# EAGLE design i2cRelay12 (EAGLE 9.2.2)
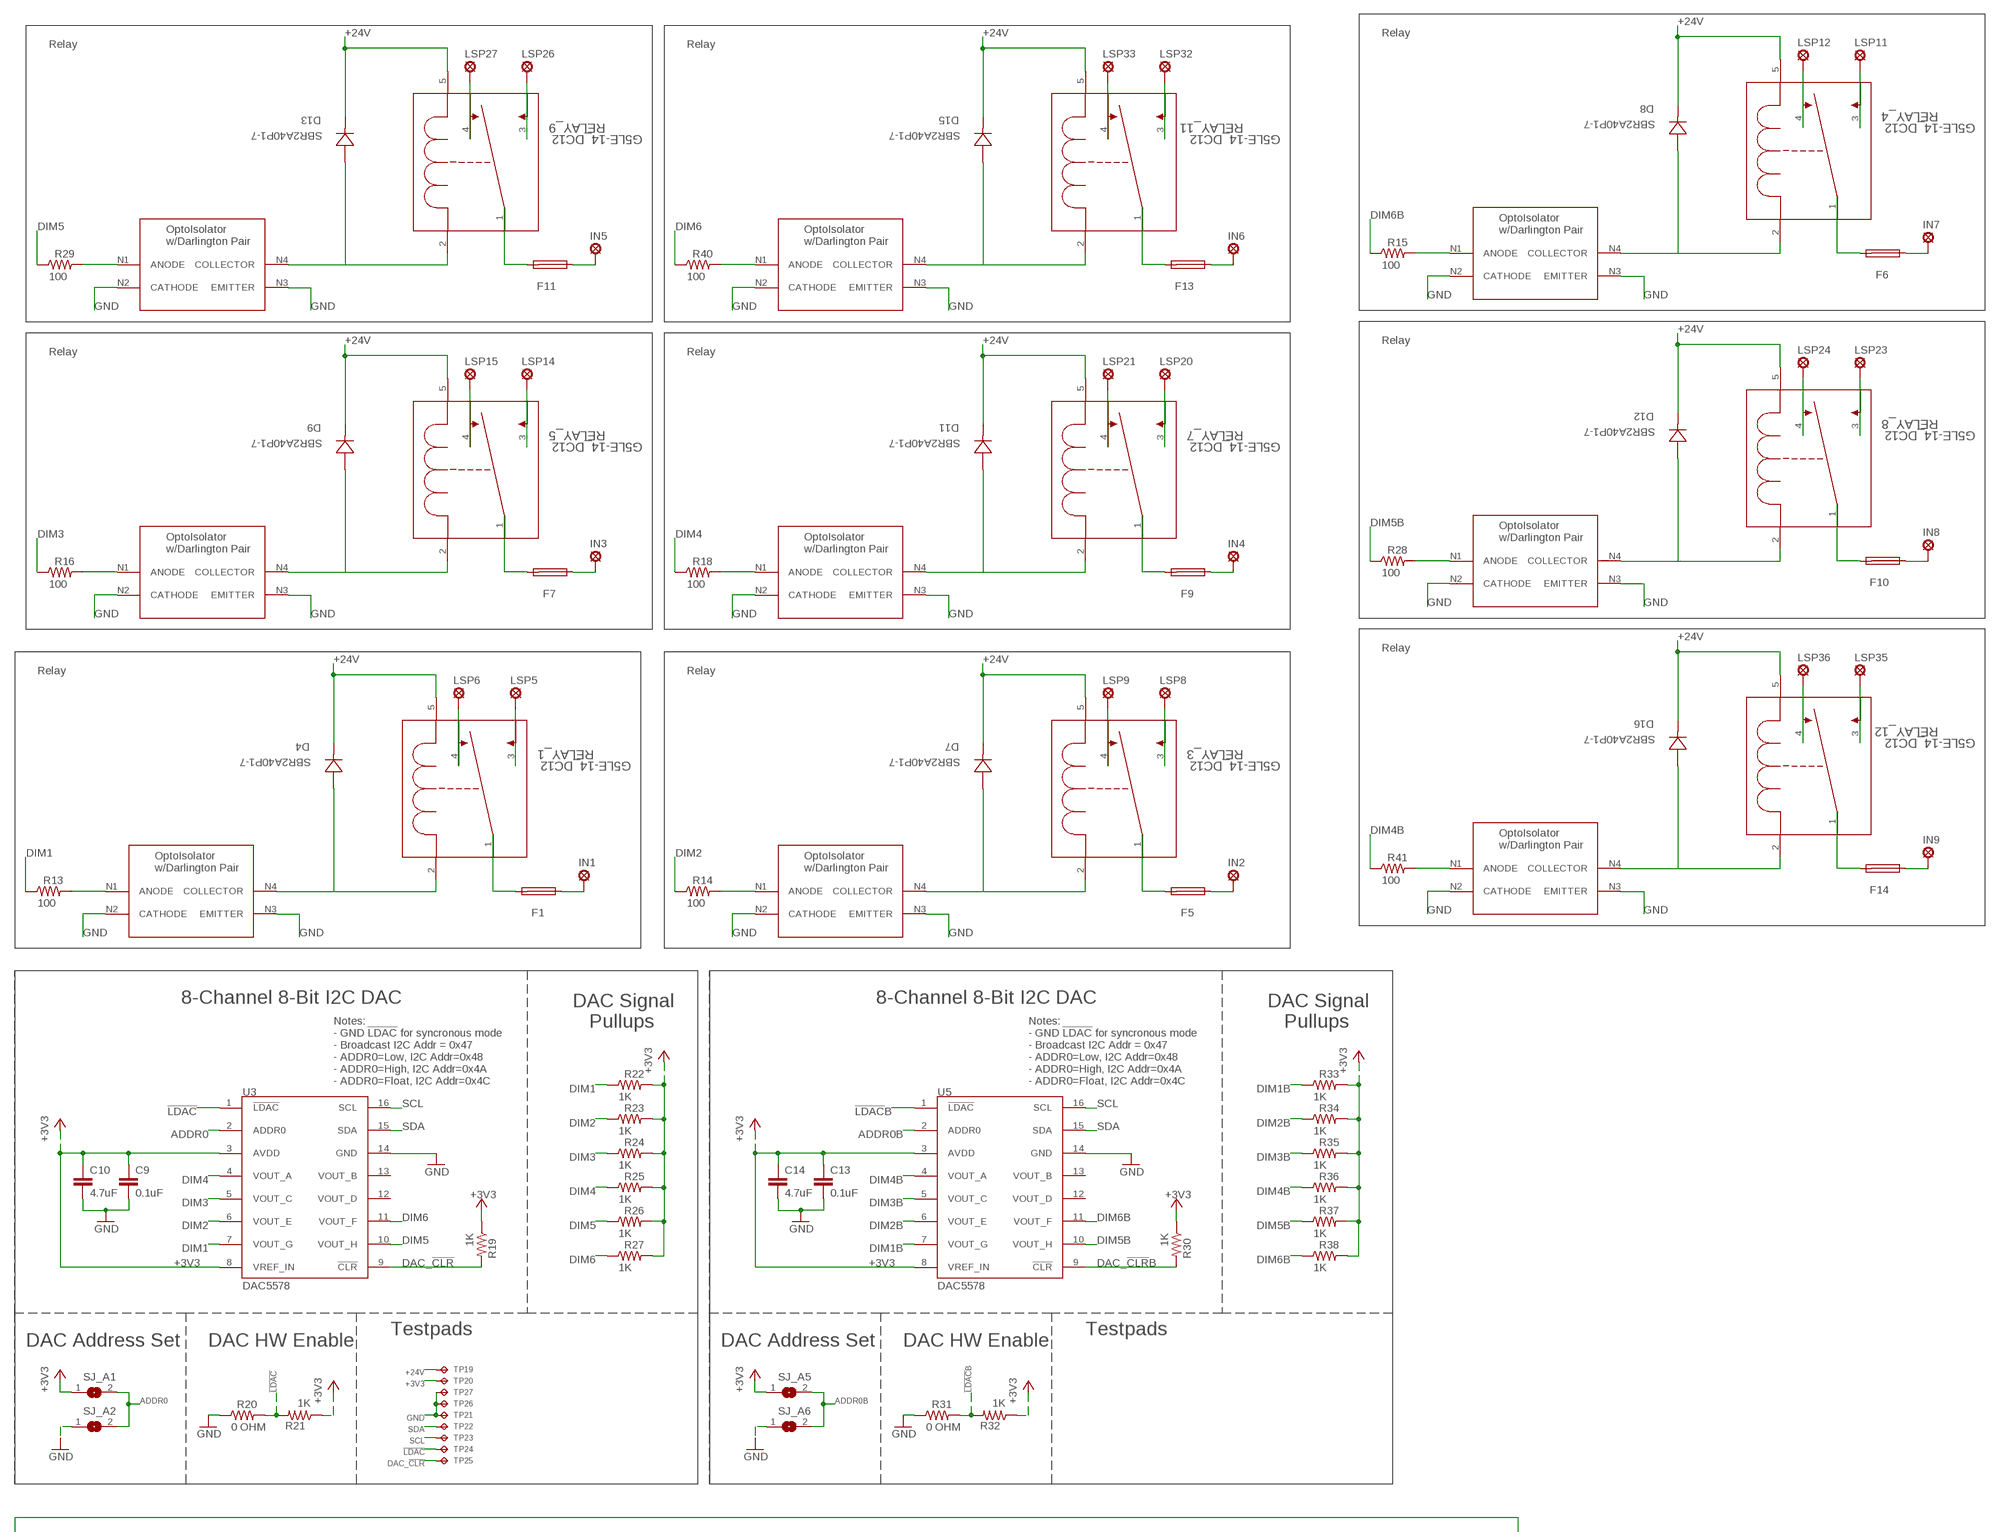
[diagram p0: schematic, sheet 1, part 1 of 3]
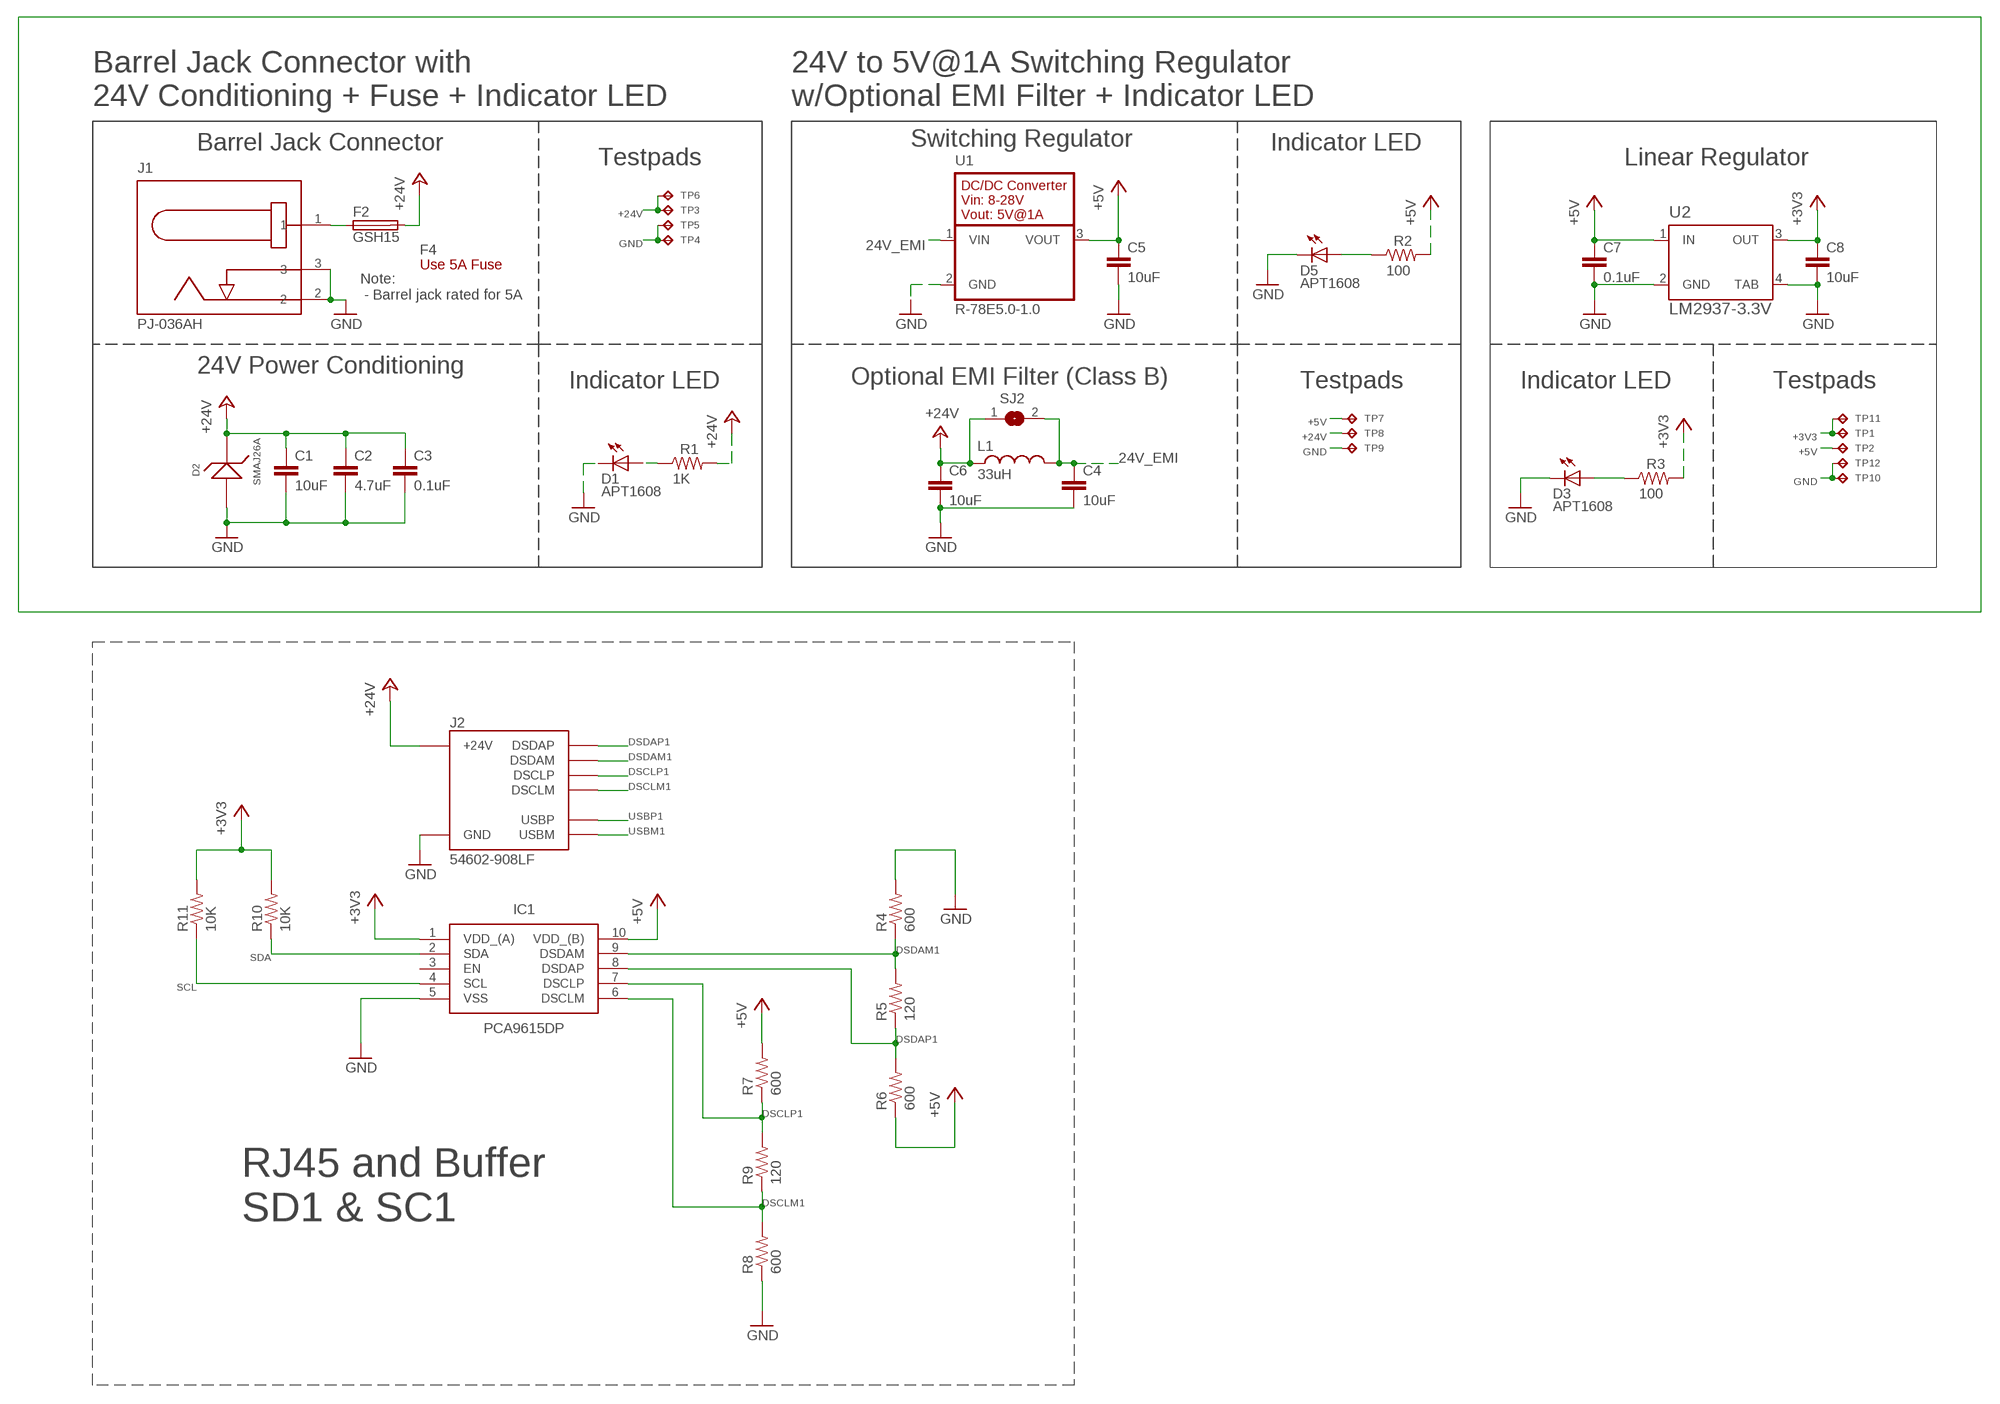
[diagram p1: schematic, sheet 1, part 2 of 3]
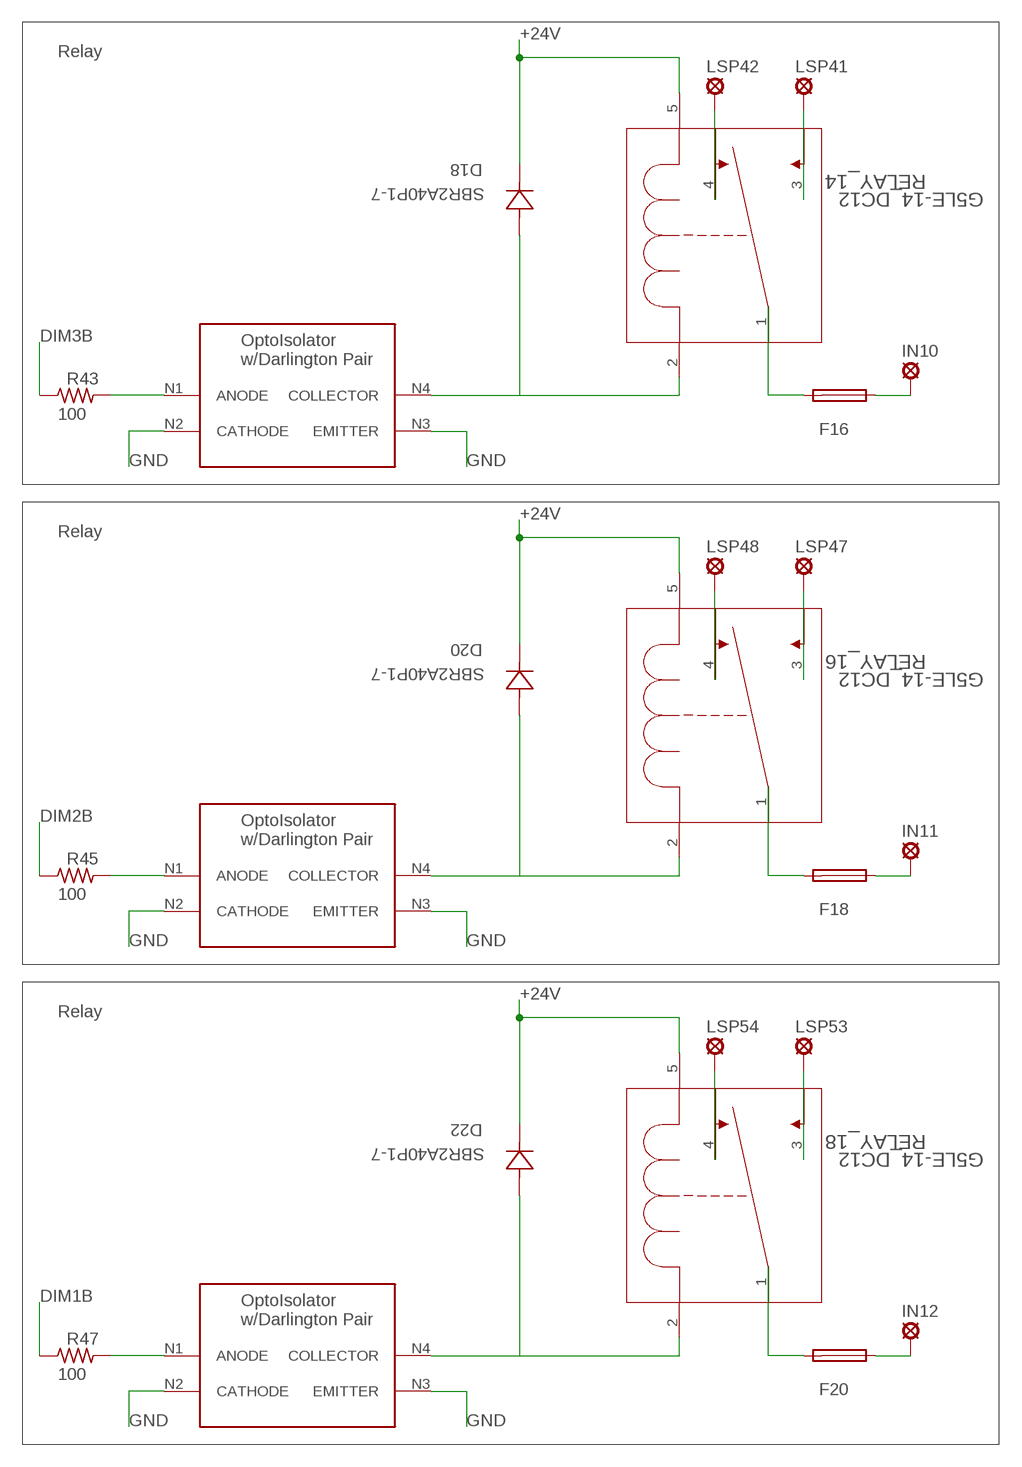
[diagram p2: schematic, sheet 1, part 3 of 3]

## Parts
C1  10uF  10UF-GMK212BBJ106KG-T  [C0805]
C2  4.7uF  4.7UF-CL21A475KBQNNNE  [C0805]
C3  0.1uF  0.1UF-C0603C104K5RACTU  [C0603]
C4  10uF  10UF-GMK212BBJ106KG-T  [C0805]
C5  10uF  10UF-GMK212BBJ106KG-T  [C0805]
C6  10uF  10UF-GMK212BBJ106KG-T  [C0805]
C7  0.1uF  0.1UF-C0603C104K5RACTU  [C0603]
C8  10uF  10UF-GMK212BBJ106KG-T  [C0805]
C9  0.1uF  0.1UF-C0603C104K5RACTU  [C0603]
C10  4.7uF  4.7UF-CL21A475KBQNNNE  [C0805]
C13  0.1uF  0.1UF-C0603C104K5RACTU  [C0603]
C14  4.7uF  4.7UF-CL21A475KBQNNNE  [C0805]
D1  APT1608  APT1608CGCK  [CHIPLED_0603]
D2  SMAJ26A  SMAJ26A-13-F  [SMA]
D3  APT1608  APT1608CGCK  [CHIPLED_0603]
D4  SBR2A40P1-7  [POWERDI123]
D5  APT1608  APT1608CGCK  [CHIPLED_0603]
D7  SBR2A40P1-7  [POWERDI123]
D8  SBR2A40P1-7  [POWERDI123]
D9  SBR2A40P1-7  [POWERDI123]
D11  SBR2A40P1-7  [POWERDI123]
D12  SBR2A40P1-7  [POWERDI123]
D13  SBR2A40P1-7  [POWERDI123]
D15  SBR2A40P1-7  [POWERDI123]
D16  SBR2A40P1-7  [POWERDI123]
D18  SBR2A40P1-7  [POWERDI123]
D20  SBR2A40P1-7  [POWERDI123]
D22  SBR2A40P1-7  [POWERDI123]
F1  GSH15  [GSH15]
F2  GSH15  [GSH15]
F4  Use 5A Fuse  0217005.MXP  [FUSE-CARTRIDGE]
F5  GSH15  [GSH15]
F6  GSH15  [GSH15]
F7  GSH15  [GSH15]
F9  GSH15  [GSH15]
F10  GSH15  [GSH15]
F11  GSH15  [GSH15]
F13  GSH15  [GSH15]
F14  GSH15  [GSH15]
F16  GSH15  [GSH15]
F18  GSH15  [GSH15]
F20  GSH15  [GSH15]
IC1  PCA9615DP  [SOP50P490X110-10N]
IN1  SE14  [SE14]
IN2  SE14  [SE14]
IN3  SE14  [SE14]
IN4  SE14  [SE14]
IN5  SE14  [SE14]
IN6  SE14  [SE14]
IN7  SE14  [SE14]
IN8  SE14  [SE14]
IN9  SE14  [SE14]
IN10  SE14  [SE14]
IN11  SE14  [SE14]
IN12  SE14  [SE14]
J1  PJ-036AH  BARREL-JACK-PJ-036AH-SMT-TR  [BARREL-JACK-PJ-036AH]
J2  54602-908LF  OPENAG-V1-RJ45PTH  [OPENAG-V1-RJ45]
L1  33uH  33UH-29333C  [29333C]
LSP5  SE14  [SE14]
LSP6  SE14  [SE14]
LSP8  SE14  [SE14]
LSP9  SE14  [SE14]
LSP11  SE14  [SE14]
LSP12  SE14  [SE14]
LSP14  SE14  [SE14]
LSP15  SE14  [SE14]
LSP20  SE14  [SE14]
LSP21  SE14  [SE14]
LSP23  SE14  [SE14]
LSP24  SE14  [SE14]
LSP26  SE14  [SE14]
LSP27  SE14  [SE14]
LSP32  SE14  [SE14]
LSP33  SE14  [SE14]
LSP35  SE14  [SE14]
LSP36  SE14  [SE14]
LSP41  SE14  [SE14]
LSP42  SE14  [SE14]
LSP47  SE14  [SE14]
LSP48  SE14  [SE14]
LSP53  SE14  [SE14]
LSP54  SE14  [SE14]
R1  1K  1K-ERJ-PB3D1001V  [RC0603N]
R2  100  100OHM-RC0603JR-07100RL  [RC0603N]
R3  100  100OHM-RC0603JR-07100RL  [RC0603N]
R4  600  R-US_R0603  [R0603]
R5  120  R-US_R0603  [R0603]
R6  600  R-US_R0603  [R0603]
R7  600  R-US_R0603  [R0603]
R8  600  R-US_R0603  [R0603]
R9  120  R-US_R0603  [R0603]
R10  10K  R-US_R0603  [R0603]
R11  10K  R-US_R0603  [R0603]
R13  100  100OHM-RC0603JR-07100RL  [RC0603N]
R14  100  100OHM-RC0603JR-07100RL  [RC0603N]
R15  100  100OHM-RC0603JR-07100RL  [RC0603N]
R16  100  100OHM-RC0603JR-07100RL  [RC0603N]
R18  100  100OHM-RC0603JR-07100RL  [RC0603N]
R19  1K  1K-ERJ-PB3D1001V  [RC0603N]
R20  0 OHM  0OHM-RC0603JR-070RL  [RC0603N]
R21  1K  1K-ERJ-PB3D1001V  [RC0603N]
R22  1K  1K-ERJ-PB3D1001V  [RC0603N]
R23  1K  1K-ERJ-PB3D1001V  [RC0603N]
R24  1K  1K-ERJ-PB3D1001V  [RC0603N]
R25  1K  1K-ERJ-PB3D1001V  [RC0603N]
R26  1K  1K-ERJ-PB3D1001V  [RC0603N]
R27  1K  1K-ERJ-PB3D1001V  [RC0603N]
R28  100  100OHM-RC0603JR-07100RL  [RC0603N]
R29  100  100OHM-RC0603JR-07100RL  [RC0603N]
R30  1K  1K-ERJ-PB3D1001V  [RC0603N]
R31  0 OHM  0OHM-RC0603JR-070RL  [RC0603N]
R32  1K  1K-ERJ-PB3D1001V  [RC0603N]
R33  1K  1K-ERJ-PB3D1001V  [RC0603N]
R34  1K  1K-ERJ-PB3D1001V  [RC0603N]
R35  1K  1K-ERJ-PB3D1001V  [RC0603N]
R36  1K  1K-ERJ-PB3D1001V  [RC0603N]
R37  1K  1K-ERJ-PB3D1001V  [RC0603N]
R38  1K  1K-ERJ-PB3D1001V  [RC0603N]
R40  100  100OHM-RC0603JR-07100RL  [RC0603N]
R41  100  100OHM-RC0603JR-07100RL  [RC0603N]
R43  100  100OHM-RC0603JR-07100RL  [RC0603N]
R45  100  100OHM-RC0603JR-07100RL  [RC0603N]
R47  100  100OHM-RC0603JR-07100RL  [RC0603N]
RELAY_1  G5LE-14_DC12  [RELAY_G5LE-1]
RELAY_3  G5LE-14_DC12  [RELAY_G5LE-1]
RELAY_4  G5LE-14_DC12  [RELAY_G5LE-1]
RELAY_5  G5LE-14_DC12  [RELAY_G5LE-1]
RELAY_7  G5LE-14_DC12  [RELAY_G5LE-1]
RELAY_8  G5LE-14_DC12  [RELAY_G5LE-1]
RELAY_9  G5LE-14_DC12  [RELAY_G5LE-1]
RELAY_11  G5LE-14_DC12  [RELAY_G5LE-1]
RELAY_12  G5LE-14_DC12  [RELAY_G5LE-1]
RELAY_14  G5LE-14_DC12  [RELAY_G5LE-1]
RELAY_16  G5LE-14_DC12  [RELAY_G5LE-1]
RELAY_18  G5LE-14_DC12  [RELAY_G5LE-1]
SJ2  EMI-BYPASS  [EMI-BYPASS]
SJ_A1  SOLDERJUMPERREFLOW_NOPASTE  [SJ1]
SJ_A2  SOLDERJUMPERREFLOW_NOPASTE  [SJ1]
SJ_A5  SOLDERJUMPERREFLOW_NOPASTE  [SJ1]
SJ_A6  SOLDERJUMPERREFLOW_NOPASTE  [SJ1]
TP1  TPTP04R  [TP04R]
TP2  TPTP04R  [TP04R]
TP3  TPTP04R  [TP04R]
TP4  TPTP04R  [TP04R]
TP5  TPTP04R  [TP04R]
TP6  TPTP04R  [TP04R]
TP7  TPTP06R  [TP06R]
TP8  TPTP06R  [TP06R]
TP9  TPTP06R  [TP06R]
TP10  TPTP04R  [TP04R]
TP11  TPTP04R  [TP04R]
TP12  TPTP04R  [TP04R]
TP19  TPTP04R  [TP04R]
TP20  TPTP04R  [TP04R]
TP21  TPTP04R  [TP04R]
TP22  TPTP04R  [TP04R]
TP23  TPTP04R  [TP04R]
TP24  TPTP04R  [TP04R]
TP25  TPTP04R  [TP04R]
TP26  TPTP04R  [TP04R]
TP27  TPTP04R  [TP04R]
U1  R-78E5.0-1.0  [R-78E5.0-1.0]
U2  LM2937-3.3V  LM2937IMP-3.3/NOPB  [MP04A]
U3  DAC5578  DAC5578SPW  [TSSOP16]
U5  DAC5578  DAC5578SPW  [TSSOP16]
U$3  LTV-355T  [LTV-355T]
U$4  LTV-355T  [LTV-355T]
U$5  LTV-355T  [LTV-355T]
U$6  LTV-355T  [LTV-355T]
U$8  LTV-355T  [LTV-355T]
U$9  LTV-355T  [LTV-355T]
U$10  LTV-355T  [LTV-355T]
U$12  LTV-355T  [LTV-355T]
U$13  LTV-355T  [LTV-355T]
U$15  LTV-355T  [LTV-355T]
U$17  LTV-355T  [LTV-355T]
U$19  LTV-355T  [LTV-355T]

## Nets
24V_EMI: C4.1 L1.2 SJ2.2 U1.1(VIN)
24V_IN1: F2.1 J1.1
!LDAC!: R20.2 R21.2 TP24.1(TP) U3.1(!LDAC!)
!LDAC!B: R31.2 R32.2 U5.1(!LDAC!)
+3V3: C8.1 C9.1 C10.1 C13.1 C14.1 IC1.1(VDD_(A)) R3.2 R10.2 R11.2 R19.1 R21.1 R22.2 R23.2 R24.2 R25.2 R26.2 R27.2 R30.1 R32.1 R33.2 R34.2 R35.2 R36.2 R37.2 R38.2 SJ_A1.1 SJ_A5.1 TP1.1(TP) TP11.1(TP) TP20.1(TP) U2.3(OUT) U3.3(AVDD) U3.8(VREF_IN) U5.3(AVDD) U5.8(VREF_IN)
+5V: C5.1 C7.1 IC1.10(VDD_(B)) R2.2 R6.1 R7.2 TP2.1(TP) TP7.TP U1.3(VOUT) U2.1(IN)
+24V: C1.1 C2.1 C3.1 C6.1 D2.1 D4.- D7.- D8.- D9.- D11.- D12.- D13.- D15.- D16.- D18.- D20.- D22.- F2.2 J2.24V(6)(+24V) L1.1 R1.2 RELAY_1.5 RELAY_3.5 RELAY_4.5 RELAY_5.5 RELAY_7.5 RELAY_8.5 RELAY_9.5 RELAY_11.5 RELAY_12.5 RELAY_14.5 RELAY_16.5 RELAY_18.5 SJ2.1 TP3.1(TP) TP6.1(TP) TP8.TP TP19.1(TP)
ADDR0: SJ_A1.2 SJ_A2.2 U3.2(ADDR0)
ADDR0B: SJ_A5.2 SJ_A6.2 U5.2(ADDR0)
DAC_!CLR!: R19.2 TP25.1(TP) U3.9(!CLR!)
DAC_!CLR!B: R30.2 U5.9(!CLR!)
DIM1: R13.1 R22.1 U3.7(VOUT_G)
DIM1B: R33.1 R47.1 U5.7(VOUT_G)
DIM2: R14.1 R23.1 U3.6(VOUT_E)
DIM2B: R34.1 R45.1 U5.6(VOUT_E)
DIM3: R16.1 R24.1 U3.5(VOUT_C)
DIM3B: R35.1 R43.1 U5.5(VOUT_C)
DIM4: R18.1 R25.1 U3.4(VOUT_A)
DIM4B: R36.1 R41.1 U5.4(VOUT_A)
DIM5: R26.1 R29.1 U3.10(VOUT_H)
DIM5B: R28.1 R37.1 U5.10(VOUT_H)
DIM6: R27.1 R40.1 U3.11(VOUT_F)
DIM6B: R15.1 R38.1 U5.11(VOUT_F)
DSCLM1: IC1.6(DSCLM) J2.DSCLM(5)(DSCLM) R8.2 R9.1
DSCLP1: IC1.7(DSCLP) J2.DSCLP(4)(DSCLP) R7.1 R9.2
DSDAM1: IC1.9(DSDAM) J2.DSDAM(2)(DSDAM) R4.1 R5.2
DSDAP1: IC1.8(DSDAP) J2.DSDAP(1)(DSDAP) R5.1 R6.2
GND: C1.2 C2.2 C3.2 C4.2 C5.2 C6.2 C7.2 C8.2 C9.2 C10.2 C13.2 C14.2 D1.C D2.2 D3.C D5.C IC1.5(VSS) J1.2 J1.3 J2.GND(3)(GND) R4.2 R8.1 R20.1 R31.1 SJ_A2.1 SJ_A6.1 TP4.1(TP) TP5.1(TP) TP9.TP TP10.1(TP) TP12.1(TP) TP21.1(TP) TP26.1(TP) TP27.1(TP) U1.2(GND) U2.2(GND) U2.4(TAB) U3.14(GND) U5.14(GND) U$3.N2(CATHODE) U$3.N3(EMITTER) U$4.N2(CATHODE) U$4.N3(EMITTER) U$5.N2(CATHODE) U$5.N3(EMITTER) U$6.N2(CATHODE) U$6.N3(EMITTER) U$8.N2(CATHODE) U$8.N3(EMITTER) U$9.N2(CATHODE) U$9.N3(EMITTER) U$10.N2(CATHODE) U$10.N3(EMITTER) U$12.N2(CATHODE) U$12.N3(EMITTER) U$13.N2(CATHODE) U$13.N3(EMITTER) U$15.N2(CATHODE) U$15.N3(EMITTER) U$17.N2(CATHODE) U$17.N3(EMITTER) U$19.N2(CATHODE) U$19.N3(EMITTER)
N$1: D1.A R1.1
N$3: D5.A R2.1
N$4: D3.A R3.1
N$7: D4.+ RELAY_1.2 U$3.N4(COLLECTOR)
N$11: F1.2 RELAY_1.1
N$13: LSP5.MP RELAY_1.3
N$14: R13.2 U$3.N1(ANODE)
N$15: LSP6.MP RELAY_1.4
N$16: F1.1 IN1.MP
N$17: D7.+ RELAY_3.2 U$4.N4(COLLECTOR)
N$18: F5.2 RELAY_3.1
N$19: LSP8.MP RELAY_3.3
N$20: R14.2 U$4.N1(ANODE)
N$21: LSP9.MP RELAY_3.4
N$22: F5.1 IN2.MP
N$23: D8.+ RELAY_4.2 U$5.N4(COLLECTOR)
N$24: F6.2 RELAY_4.1
N$25: LSP11.MP RELAY_4.3
N$26: R15.2 U$5.N1(ANODE)
N$27: LSP12.MP RELAY_4.4
N$28: F6.1 IN7.MP
N$29: D9.+ RELAY_5.2 U$6.N4(COLLECTOR)
N$30: F7.2 RELAY_5.1
N$31: LSP14.MP RELAY_5.3
N$32: R16.2 U$6.N1(ANODE)
N$33: LSP15.MP RELAY_5.4
N$34: F7.1 IN3.MP
N$41: D11.+ RELAY_7.2 U$8.N4(COLLECTOR)
N$42: F9.2 RELAY_7.1
N$43: LSP20.MP RELAY_7.3
N$44: R18.2 U$8.N1(ANODE)
N$45: LSP21.MP RELAY_7.4
N$46: F9.1 IN4.MP
N$47: D12.+ RELAY_8.2 U$9.N4(COLLECTOR)
N$48: F10.2 RELAY_8.1
N$49: LSP23.MP RELAY_8.3
N$50: R28.2 U$9.N1(ANODE)
N$51: LSP24.MP RELAY_8.4
N$52: F10.1 IN8.MP
N$53: D13.+ RELAY_9.2 U$10.N4(COLLECTOR)
N$54: F11.2 RELAY_9.1
N$55: LSP26.MP RELAY_9.3
N$56: R29.2 U$10.N1(ANODE)
N$57: LSP27.MP RELAY_9.4
N$58: F11.1 IN5.MP
N$65: D15.+ RELAY_11.2 U$12.N4(COLLECTOR)
N$66: F13.2 RELAY_11.1
N$67: LSP32.MP RELAY_11.3
N$68: R40.2 U$12.N1(ANODE)
N$69: LSP33.MP RELAY_11.4
N$70: F13.1 IN6.MP
N$71: D16.+ RELAY_12.2 U$13.N4(COLLECTOR)
N$72: F14.2 RELAY_12.1
N$73: LSP35.MP RELAY_12.3
N$74: R41.2 U$13.N1(ANODE)
N$75: LSP36.MP RELAY_12.4
N$76: F14.1 IN9.MP
N$83: D18.+ RELAY_14.2 U$15.N4(COLLECTOR)
N$84: F16.2 RELAY_14.1
N$85: LSP41.MP RELAY_14.3
N$86: R43.2 U$15.N1(ANODE)
N$87: LSP42.MP RELAY_14.4
N$88: F16.1 IN10.MP
N$95: D20.+ RELAY_16.2 U$17.N4(COLLECTOR)
N$96: F18.2 RELAY_16.1
N$97: LSP47.MP RELAY_16.3
N$98: R45.2 U$17.N1(ANODE)
N$99: LSP48.MP RELAY_16.4
N$100: F18.1 IN11.MP
N$107: D22.+ RELAY_18.2 U$19.N4(COLLECTOR)
N$108: F20.2 RELAY_18.1
N$109: LSP53.MP RELAY_18.3
N$110: R47.2 U$19.N1(ANODE)
N$111: LSP54.MP RELAY_18.4
N$112: F20.1 IN12.MP
SCL: IC1.4(SCL) R11.1 TP23.1(TP) U3.16(SCL) U5.16(SCL)
SDA: IC1.2(SDA) R10.1 TP22.1(TP) U3.15(SDA) U5.15(SDA)
USBM1: J2.USBM(8)(USBM)
USBP1: J2.USBP(7)(USBP)
Unconnected: IC1.3(EN) U3.12(VOUT_D) U3.13(VOUT_B) U5.12(VOUT_D) U5.13(VOUT_B)

## Notes on the sheet
- Relay | Relay
- Relay | Relay
- Relay | Relay
- Relay | Relay
- Relay | Relay
- Relay | Relay
- 8-Channel 8-Bit I2C DAC | 8-Channel 8-Bit I2C DAC
- DAC Signal 
     Pullups
- DAC Signal 
     Pullups
- Notes:
  - GND !LDAC! for syncronous mode
  - Broadcast I2C Addr = 0x47
  - ADDR0=Low, I2C Addr=0x48
  - ADDR0=High, I2C Addr=0x4A
  - ADDR0=Float, I2C Addr=0x4C
- Notes:
  - GND !LDAC! for syncronous mode
  - Broadcast I2C Addr = 0x47
  - ADDR0=Low, I2C Addr=0x48
  - ADDR0=High, I2C Addr=0x4A
  - ADDR0=Float, I2C Addr=0x4C
- Testpads | Testpads
- DAC Address Set | DAC HW Enable | DAC Address Set | DAC HW Enable
- Barrel Jack Connector with
  24V Conditioning + Fuse + Indicator LED
- 24V to 5V@1A Switching Regulator
  w/Optional EMI Filter + Indicator LED
- Barrel Jack Connector | Switching Regulator | Indicator LED
- Testpads | Linear Regulator
- Note:
   - Barrel jack rated for 5A
- 24V Power Conditioning
- Indicator LED | Optional EMI Filter (Class B) | Testpads | Indicator LED | Testpads
- RJ45 and Buffer
  SD1 & SC1

## Library data of the parts
C1 C4-C6 C8 = openag-capacitors:10UF-GMK212BBJ106KG-T: CAP CER 10UF 35V X5R 0805 Description: 10µF ±10% 35V Ceramic Capacitor X5R 0805 (2012 Metric) Technical Specifications: Capacitance: 10µF Tolerance: ±10% Rated Voltage: 35V Temperature Coefficient: X5R Operating Temperature: -55°C ~ 85°C Package / Case: 0805 (2012 Metric) Datasheet(s): GMK212BBJ106KG-T Spec <http://ds.yuden.co.jp/TYCOMPAS/ut/detail.do?productNo=GMK212BBJ106KG-T&fileName=GMK212BBJ106KG-T_SS&mode=specSheetDownload> Vendor(s): Digikey: 587-4893-1-ND <https://www.digikey.com/product-detail/en/taiyo-yuden/GMK212BBJ106KG-T/587-4893-1-ND/6563736>; MANUFACTURER: Taiyo Yuden; MPN: GMK212BBJ106KG-T; VENDOR: Digikey; VLINK: https://www.digikey.com/product-detail/en/taiyo-yuden/GMK212BBJ106KG-T/587-4893-1-ND/6563736; VPN: 587-4893-1-ND
C2 C10 C14 = openag-capacitors:4.7UF-CL21A475KBQNNNE: CAP CER 4.7UF 50V X5R 0805 Description: 4.7µF ±10% 50V Ceramic Capacitor X5R 0805 (2012 Metric) Technical Specifications: Capacitance: 4.7uF Tolerance: ±10% Rated Voltage: 50V Temperature Coefficient: X5R Operating Temperature: -55°C ~ 85°C Package/Case: 0805 (2012 Metric) Datasheet(s): CL21A475KBQNNNE Characteristics <http://www.samsungsem.com/kr/front/downloadcms.do?path=/kr/support/product-search/mlcc/__icsFiles/afieldfile/2014/11/05&fileName=C_CL21A475KBQNNNE.pdf> Vendor(s): Digikey: 1276-1248-1-ND <https://www.digikey.com/product-detail/en/samsung-electro-mechanics/CL21A475KBQNNNE/1276-1248-1-ND/3889334>; MANUFACTURER: Samsung; MPN: CL21A475KBQNNNE; VENDOR: Digikey; VLINK: https://www.digikey.com/product-detail/en/samsung-electro-mechanics/CL21A475KBQNNNE/1276-1248-1-ND/3889334; VPN: 1276-1248-1-ND
C3 C7 C9 C13 = openag-capacitors:0.1UF-C0603C104K5RACTU: CAP CER 0.1UF 50V X7R 0603 Description: 0.1µF ±10% 50V Ceramic Capacitor X7R 0603 (1608 Metric) Technical Specifications: Capacitance: 0.1µF Tolerance: ±10% Rated Voltage: 50V Temperature Coefficient: X7R Operating Temperature: -55°C ~ 125°C Package / Case: 0603 (1608 Metric) Datasheet(s): X7R Dielectric, 6.3-250 VDC <https://search.kemet.com/component-edge/download/datasheet/C0603C104K5RACTU.pdf> Vendor(s): Digikey: 399-5089-1-ND <https://www.digikey.com/product-detail/en/kemet/C0603C104K5RACTU/399-5089-1-ND/1465623>; MANUFACTURER: Kemet; MPN: C0603C104K5RACTU; VENDOR: Digikey; VLINK: https://www.digikey.com/product-detail/en/kemet/C0603C104K5RACTU/399-5089-1-ND/1465623; VPN: 399-5089-1-ND
D1 D3 D5 = openag-diodes:APT1608CGCK: LED GREEN CLEAR 0603 SMD Description: Green 570nm LED Indication - Discrete 2.1V 0603 (1608 Metric) Technical Specifications: Color: Green Lens Color: Colorless Lens Transparency: Clear Millicandela Rating: 50mcd Lens Style/Size: Rectangle with Flat Top, 1.20mm x 0.80mm Voltage - Forward (Vf) (Typ): 2.1V Current - Test: 20mA Viewing Angle: 120° Mounting Type: Surface Mount Wavelength - Dominant: 570nm Wavelength - Peak: 574nm Package / Case: 0603 (1608 Metric) Supplier Device Package: Chip LED Size / Dimension: 1.60mm L x 0.80mm W Height (Max): 0.75mm Datasheet(s): APT1608CGCK <http://www.kingbrightusa.com/images/catalog/SPEC/APT1608CGCK.pdf> Vendor(s): Digikey: 754-1116-1-ND <https://www.digikey.com/product-detail/en/kingbright/APT1608CGCK/754-1116-1-ND/1747833#>; MANUFACTURER: Kingbright; MPN: APT1608CGCK; VENDOR: Digikey; VLINK: https://www.digikey.com/product-detail/en/kingbright/APT1608CGCK/754-1116-1-ND/1747833#; VPN: 754-1116-1-ND
D2 = openag-diodes:SMAJ26A-13-F: TVS DIODE 26VWM 42.1VC SMA Description: TVS DIODE 26VWM 42.1VC SMA Technical Specifications: Type: Zener Voltage - Reverse Standoff (Typ): 26V Voltage - Breakdown (Min): 28.9V Voltage - Clamping (Max) @ Ipp: 42.1V Current - Peak Pulse (10/1000µs): 9.5A Power - Peak Pulse: 400W Power Line Protection: No Operating Temperature: -55°C ~ 150°C (TJ) DO-214AC, SMA Datasheet(s): SMAJ5.0(C)A - SMAJ200(C)A Vendor(s): Digikey: SMAJ26A-FDICT-ND <https://www.digikey.com/product-detail/en/diodes-incorporated/SMAJ26A-13-F/SMAJ26A-FDICT-ND/806583>; MANUFACTURER: Diodes Incorporated; MPN: SMAJ26A-13-F; VENDOR: Digikey; VLINK: https://www.digikey.com/product-detail/en/diodes-incorporated/SMAJ26A-13-F/SMAJ26A-FDICT-ND/806583; VPN: SMAJ26A-FDICT-ND
D4 D7-D9 D11-D13 D15 D16 D18 D20 D22 = openag-diodes:SBR2A40P1-7: DIODE SBR 40V 2A POWERDI123 Description: Diode Super Barrier 40V 2A Surface Mount PowerDI™ 123 Technical Specifications: Diode Type: Super Barrier Voltage - DC Reverse (Vr) (Max): 40V Current - Average Rectified (Io): 2A Voltage - Forward (Vf) (Max) @ If: 500mV @ 2A Speed: Standard Recovery >500ns, > 200mA (Io) Current - Reverse Leakage @ Vr: 100µA @ 40V Mounting Type: Surface Mount Package / Case: POWERDI®123 Supplier Device Package: PowerDI™ 123 Operating Temperature - Junction: -65°C ~ 150°C Base Part Number: SBR2A40 Datasheet(s): SBR2A40P1 <https://www.diodes.com/assets/Datasheets/SBR2A40P1.pdf> Vendor(s): Digikey: SBR2A40P1DITR-ND <https://www.digikey.com/product-detail/en/diodes-incorporated/SBR2A40P1-7/SBR2A40P1DITR-ND/1681825>; MANUFACTURER: Diodes Incorporated; MPN: SBR2A40P1-7; VENDOR: Digikey; VLINK: https://www.digikey.com/product-detail/en/diodes-incorporated/SBR2A40P1-7/SBR2A40P1DITR-ND/1681825; VPN: SBR2A40P1DITR-ND
F1 F5-F7 F9-F11 F13 F14 F16 F18 F20 = fuse:GSH15: FUSE HOLDER grid 15mm, 19649 Wickmann; MPN: 64900001039; OC_FARNELL: 1271673; OC_NEWARK: 02P0318
F2 = openag-fuses:GSH15: FUSE BLOCK CART 250V 6.3A PCB Description: Fuse Block 6.3A 250V 1 Circuit Cartridge PCB Technical Specifications: Fuseholder Type: Block Fuse Type: Cartridge For Use With/Related Products: 5mm x 20mm Fuse Size: 5mm x 20mm Number of Circuits: 1 Voltage: 250V Current Rating: 6.3A Mounting Type: PCB Orientation: Horizontal Termination Style: PC Pin Contact Material: Copper Alloy Contact Finish: Tin Datasheet(s): 649 Series <http://www.littelfuse.com/~/media/electronics/datasheets/fuse_blocks/littelfuse_fuse_block_649_datasheet.pdf.pdf> Vendor(s): Digikey: WK0011-ND <https://www.digikey.com/product-detail/en/littelfuse-inc/64900001039/WK0011-ND/245470>; MANUFACTURER: Littelfuse Inc.; MPN: 64900001039; VENDOR: Digikey; VLINK: https://www.digikey.com/product-detail/en/littelfuse-inc/64900001039/WK0011-ND/245470; VPN: WK0011-ND
F4 = openag-fuses:0217005.MXP: FUSE GLASS 5A 250VAC 5X20MM Description: FUSE GLASS 5A 250VAC 5X20MM Technical Specifications: Fuse Type: Cartridge, Glass Current Rating: 5A Voltage Rating - AC: 250V Response Time: Fast Package / Case: 5mm x 20mm Mounting Type: Holder Breaking Capacity @ Rated Voltage: 50A Melting I²t: 42.795 Approvals: BSI, CE, CCC, CSA, KC, PSE, SEMKO, UR, VDE Operating Temperature: -55°C ~ 125°C Size / Dimension: 0.205" Dia x 0.787" L (5.20mm x 20.00mm) DC Cold Resistance: 0.0137 Ohms Datasheet(s): 217 Series Datasheet <http://www.littelfuse.com/~/media/electronics/datasheets/fuses/littelfuse_fuse_217_datasheet.pdf.pdf> Vendor(s): Digikey: F1725-ND <https://www.digikey.com/product-detail/en/littelfuse-inc/0217005.MXP/F1725-ND/777549#>; MANUFACTURER: Littelfuse Inc.; MPN: 0217005.MXP; VENDOR: Digikey; VLINK: https://www.digikey.com/product-detail/en/littelfuse-inc/0217005.MXP/F1725-ND/777549; VPN: F1725-ND
IC1 = PCA9615DP:PCA9615DP: Buffer, ReDriver 2 Channel 400kHz 10-TSSOP Source: Datasheet <http://www.nxp.com/docs/en/data-sheet/PCA9615.pdf>; DESCRIPTION: Buffer, ReDriver 2 Channel 400kHz 10-TSSOP; HEIGHT: 1.1mm; MANUFACTURER_NAME: Nexperia; MANUFACTURER_PART_NUMBER: PCA9615DP; SUPPLIER_NAME: RS
IN1-IN12 LSP5 LSP6 LSP8 LSP9 LSP11 LSP12 LSP14 LSP15 LSP20 LSP21 LSP23 LSP24 LSP26 LSP27 LSP32 LSP33 LSP35 LSP36 LSP41 LSP42 LSP47 LSP48 LSP53 LSP54 = solpad:SE14: SOLDER PAD E1553, drill 1,4mm, distributor Buerklin, 07F820
J1 = openag-connectors:BARREL-JACK-PJ-036AH-SMT-TR: CONN PWR JACK 2X5.5MM SOLDER Description: Power Barrel Connector Jack 2.10mm ID (0.083"), 5.50mm OD (0.217") Surface Mount, Right Angle Technical Specifications: Connector Type: Jack Gender: Male Industry Recognized Mating Diameter: 2.10mm ID (0.083"), 5.50mm OD (0.217") Actual Diameter: 0.078" (2.00mm ID), 0.248" (6.30mm OD) Number of Positions/Contacts: 2 Conductors, 3 Contacts Internal Switch(s): Single Switch, Normally Closed Mounting Type: Surface Mount, Right Angle Termination: Solder Shielding: Unshielded Voltage - Rated: 24VDC Current Rating: 5A Mating Length/Depth: 0.360" (9.15mm) Contact Material - Plating: Silver Operating Temperature: -25°C ~ 85°C Housing Material: Polyamide (PA6T), Nylon 6T Contact Material: Brass; Copper Alloy Body Color: Black Datasheet(s): PJ-036AH-SMT-TR <http://www.cui.com/product/resource/digikeypdf/pj-036ah-smt-tr.pdf> Vendor(s): Digikey: CP-036AHPJCT-ND <https://www.digikey.com/product-detail/en/cui-inc/PJ-036AH-SMT-TR/CP-036AHPJCT-ND/1530994>; MANUFACTURER: CUI Inc.; MPN: PJ-036AH-SMT-TR; VENDOR: Digikey; VLINK: https://www.digikey.com/product-detail/en/cui-inc/PJ-036AH-SMT-TR/CP-036AHPJCT-ND/1530994; VPN: CP-036AHPJCT-ND
J2 = openag_connector:OPENAG-V1-RJ45: Amphenol FCI - 54602-908LF - CONN MOD JACK 8P8C R/A UNSHLD Description: Jack Modular Connector 8p8c (RJ45, Ethernet) 90� Angle (Right) Unshielded Cat3 Technical Specifications: Connector Type: Jack Number of Positions/Contacts: 8p8c (RJ45, Ethernet) Number of Ports: 1 Number of Rows: 1 Mounting Type: Through Hole Orientation: 90� Angle (Right) Termination: Solder Shielding: Unshielded Ratings: Cat3 Features: Board Lock LED Color: Does Not Contain LED Tab Direction: Down Contact Material: Copper Alloy Contact Finish: Gold Contact Finish Thickness: 15�in (0.38�m) Housing Material: Polyester, Glass Filled Operating Temperature: -40�C ~ 70�C Datasheet(s): 54601-x04(zzz)WPLF Drawing <http://cdn.amphenol-icc.com/media/wysiwyg/files/drawing/c-bmj-0102.pdf> Vendor(s): Digikey: 609-1046-ND <https://www.digikey.com/product-detail/en/amphenol-fci/54602-908LF/609-1046-ND/1001360>; POPULATE: YES; VERIFIED: NO
L1 = openag-inductors:33UH-29333C: FIXED IND 33UH 1A 120 MOHM SMD Description: 33µH Shielded Wirewound Inductor 1A 120 mOhm Max Nonstandard Technical Specifications: Type: Wirewound Inductance: 33µH Current Rating: 1A Shielding: Shielded DC Resistance (DCR): 120 mOhm Max Operating Temperature: -40°C ~ 85°C Frequency - Test: 10kHz Mounting Type: Surface Mount Package / Case: Nonstandard Size / Dimension: 0.283" L x 0.283" W (7.20mm x 7.20mm) Height - Seated (Max): 0.157" (4.00mm) Datasheet(s): 2900 Series <https://www.murata-ps.com/data/magnetics/kmp_2900.pdf> Vendor(s): Digikey: 811-1138-1-ND <https://www.digikey.com/product-detail/en/murata-power-solutions-inc/29333C/811-1138-1-ND/1924860>; MANUFACTURER: Murata Power Solutions Inc.; MPN: 29333C; VENDOR: Digikey; VLINK: https://www.digikey.com/product-detail/en/murata-power-solutions-inc/29333C/811-1138-1-ND/1924860; VPN: 811-1138-1-ND
R1 R19 R21-R27 R30 R32-R38 = openag-resistors:1K-ERJ-PB3D1001V: RES SMD 1K OHM 0.5% 1/5W 0603 Description: 1 kOhms ±0.5% 0.2W, 1/5W Chip Resistor 0603 (1608 Metric) Automotive AEC-Q200, Pulse Withstanding Thick Film Technical Specifications: Resistance: 1 kOhms Tolerance: ±0.5% Power: 0.2W, 1/5W Operating Temperature: -55°C ~ 155°C Package / Case: 0603 (1608 Metric) Datasheet(s): ERJ-PB3, PB6 Series, High Precision Datasheet <https://industrial.panasonic.com/cdbs/www-data/pdf/RDM0000/AOA0000C328.pdf> Vendor(s): Digikey: P20283CT-ND <https://www.digikey.com/product-detail/en/panasonic-electronic-components/ERJ-PB3D1001V/P20283CT-ND/6214538>; MANUFACTURER: Panasonic; MPN: P20283CT-ND; VENDOR: Digikey; VLINK: https://www.digikey.com/product-detail/en/panasonic-electronic-components/ERJ-PB3D1001V/P20283CT-ND/6214538; VPN: P20283CT-ND
R2 R3 R13-R16 R18 R28 R29 R40 R41 R43 R45 R47 = openag-resistors:100OHM-RC0603JR-07100RL: RES SMD 100 OHM 5% 1/10W 0603 Description: 100 Ohms ±5% 0.1W, 1/10W Chip Resistor 0603 (1608 Metric) Moisture Resistant Thick Film Technical Specifications: Resistance: 100 Ohms Tolerance: ±5% Power (Watts): 0.1W, 1/10W Composition: Thick Film Features: Moisture Resistant Temperature Coefficient: ±100ppm/°C Operating Temperature: -55°C ~ 155°C Package / Case: 0603 (1608 Metric) Supplier Device Package: 0603 Size / Dimension: 0.063" L x 0.032" W (1.60mm x 0.80mm) Height - Seated (Max): 0.022" (0.55mm) Number of Terminations: 2 Datasheet(s): Thick Film Chip Resistor Intro <http://www.yageo.com.tw/exep/pages/download/literatures/PYu-R_INT-thick_7.pdf> Chip Resistor Marking <http://www.yageo.com/exep/pages/download/literatures/PYu-R_Marking_2.pdf> RC Series, L Datasheet <http://www.yageo.com/documents/recent/PYu-RC_Group_51_RoHS_L_8.pdf> Vendor(s): Digikey: 311-100GRCT-ND <https://www.digikey.com/product-detail/en/yageo/RC0603JR-07100RL/311-100GRCT-ND/729644>; MANUFACTURER: Yageo; MPN: RC0603JR-07100RL; VENDOR: Digikey; VLINK: https://www.digikey.com/product-detail/en/yageo/RC0603JR-07100RL/311-100GRCT-ND/729644; VPN: 311-100GRCT-ND
R4-R11 = rcl:R-US_: RESISTOR, American symbol
R20 R31 = openag-resistors:0OHM-RC0603JR-070RL: RES SMD 0 OHM JUMPER 1/10W 0603 Description: 0 Ohms Jumper 0.1W, 1/10W Chip Resistor 0603 (1608 Metric) Moisture Resistant Thick Film Technical Specifications: Resistance: 0 Ohms Power: 0.1W, 1/10W Operating Temperature: -55°C ~ 155°C Package / Case: 0603 (1608 Metric) Datasheet(s): RC Series, L Datasheet <http://www.yageo.com/documents/recent/PYu-RC_Group_51_RoHS_L_8.pdf> Vendor(s): Digikey: 311-0.0GRCT-ND <https://www.digikey.com/product-detail/en/yageo/RC0603JR-070RL/311-0.0GRCT-ND/729622>; MANUFACTURER: Yageo; MPN: RC0603JR-070RL; VENDOR: Digikey; VLINK: https://www.digikey.com/product-detail/en/yageo/RC0603JR-070RL/311-0.0GRCT-ND/729622; VPN: 311-0.0GRCT-ND
RELAY_1 RELAY_3-RELAY_5 RELAY_7-RELAY_9 RELAY_11 RELAY_12 RELAY_14 RELAY_16 RELAY_18 = relay_2:G5LE-14_DC12; MANUFACTURER_PART_NUMBER: G5LE14 DC12; VENDOR: OMRON
SJ2 = openag-connectors:EMI-BYPASS: EMI Bypass Solder Jumper; MPN: N/A
SJ_A1 SJ_A2 SJ_A5 SJ_A6 = openag-connectors:SOLDERJUMPER: SMD Solder JUMPER Solder the two pads together to create a connection, or remove the solder to break it. REFLOW - Use this footprint for solder paste and reflow ovens. WAVE - Use this footprint for hand-soldering (larger pads). CLOSED - Has a trace between the two pads to ensure it is closed by default. The trace needs to be cut to disable the jumper, and can be closed again by creating a solder bridge between the two pads.; MPN: N/A
TP1-TP12 TP19-TP27 = openag-testpads:TP: Test pad; MPN: N/A
U1 = openag-regulators:R-78E5.0-1.0: DC/DC CONVERTER 5V 5W Description: Linear Regulator Replacement DC DC Converter 1 Output 5V 1A 8V - 28V Input Technical Specifications: Type: Linear Regulator Replacement Number of Outputs: 1 Voltage - Input (Min): 8V Voltage - Input (Max): 28V Voltage - Output 1: 5V Current - Output (Max): 1A Power (Watts): 5W Applications: ITE (Commercial) Features: SCP Operating Temperature: -40°C ~ 85°C Efficiency: 91% Mounting Type: Through Hole Package / Case: 3-SIP Module Size / Dimension: 0.46" L x 0.33" W x 0.41" H (11.6mm x 8.5mm x 10.4mm) Datasheet(s): R-78E-1.0 Series Datasheet <https://www.recom-power.com/pdf/Innoline/R-78Exx-1.0.pdf> Vendor(s): Digikey: 945-2201-ND <https://www.digikey.com/product-detail/en/recom-power/R-78E5.0-1.0/945-2201-ND/4930585>; MANUFACTURER: Recom Power; MPN: R-78E5.0-1.0; VENDOR: Digikey; VLINK: https://www.digikey.com/product-detail/en/recom-power/R-78E5.0-1.0/945-2201-ND/4930585; VPN: 945-2201-ND
U2 = openag-regulators:LM2937IMP-3.3/NOPB: IC REG LIN 3.3V 400MA SOT223-4 Description: Linear Voltage Regulator IC Positive Fixed 1 Output 3.3V 400mA SOT-223-4 Technical Specifications: Output Configuration: Positive Output Type: Fixed Number of Regulators: 1 Voltage - Input (Max): 26V Voltage - Output (Min/Fixed): 3.3V Voltage Dropout (Max): 1V @ 50mA Current - Output: 400mA Current - Quiescent (Iq): 2mA Current - Supply (Max): 1.25A Protection Features: Over Temperature, Reverse Polarity, Short Circuit Operating Temperature: -40°C ~ 85°C Mounting Type: Surface Mount Package / Case: TO-261-4, TO-261AA Supplier Device Package: SOT-223-4 Base Part Number: LM2937 Datasheet(s): LM2937-2.5, LM2937-3.3 Datasheet <http://www.ti.com/lit/ds/symlink/lm2937-2.5.pdf> Vendor(s): Digikey: LM2937IMP-3.3/NOPBCT-ND <https://www.digikey.com/product-detail/en/texas-instruments/LM2937IMP-3.3-NOPB/LM2937IMP-3.3-NOPBCT-ND/270742#>; MANUFACTURER: Texas Instruments; MPN: LM2937IMP-3.3/NOPB; VENDOR: Digikey; VLINK: https://www.digikey.com/product-detail/en/texas-instruments/LM2937IMP-3.3-NOPB/LM2937IMP-3.3-NOPBCT-ND/270742#; VPN: LM2937IMP-3.3/NOPBCT-ND
U3 U5 = openag-dacs:DAC5578SPW: IC DAC 8BIT I2C OCTAL 16TSSOP Description: 8 Bit Digital to Analog Converter 8 16-TSSOP Technical Specifications: Number of Bits: 8 Number of D/A Converters: 8 Settling Time: 12µs (Typ) Output Type: Voltage - Buffered Differential Output: No Data Interface: I²C Reference Type: External Voltage - Supply, Analog: 2.7 V ~ 5.5 V Voltage - Supply, Digital: 2.7 V ~ 5.5 V INL/DNL (LSB): ±0.01, ±0.01 Architecture: String DAC Operating Temperature: -40°C ~ 125°C Package / Case: 16-TSSOP (0.173", 4.40mm Width) Supplier Device Package: 16-TSSOP Base Part Number: DAC5578 Datasheet(s): DAC5578,6578,7578 <http://www.ti.com/lit/ds/symlink/dac5578.pdf> Analog Signal Chain Guide <http://www.ti.com/lit/pdf/slyb174> Vendor(s): Digikey: 296-27736-5-ND <https://www.digikey.com/product-detail/en/texas-instruments/DAC5578SPW/296-27736-5-ND/2360827>; MANUFACTURER: Texas Instruments; MPN: DAC5578SPW; VENDOR: Digikey; VLINK: https://www.digikey.com/product-detail/en/texas-instruments/DAC5578SPW/296-27736-5-ND/2360827; VPN: 296-27736-5-ND
U$3-U$6 U$8-U$10 U$12 U$13 U$15 U$17 U$19 = openag-transistors:LTV-355T

## Board
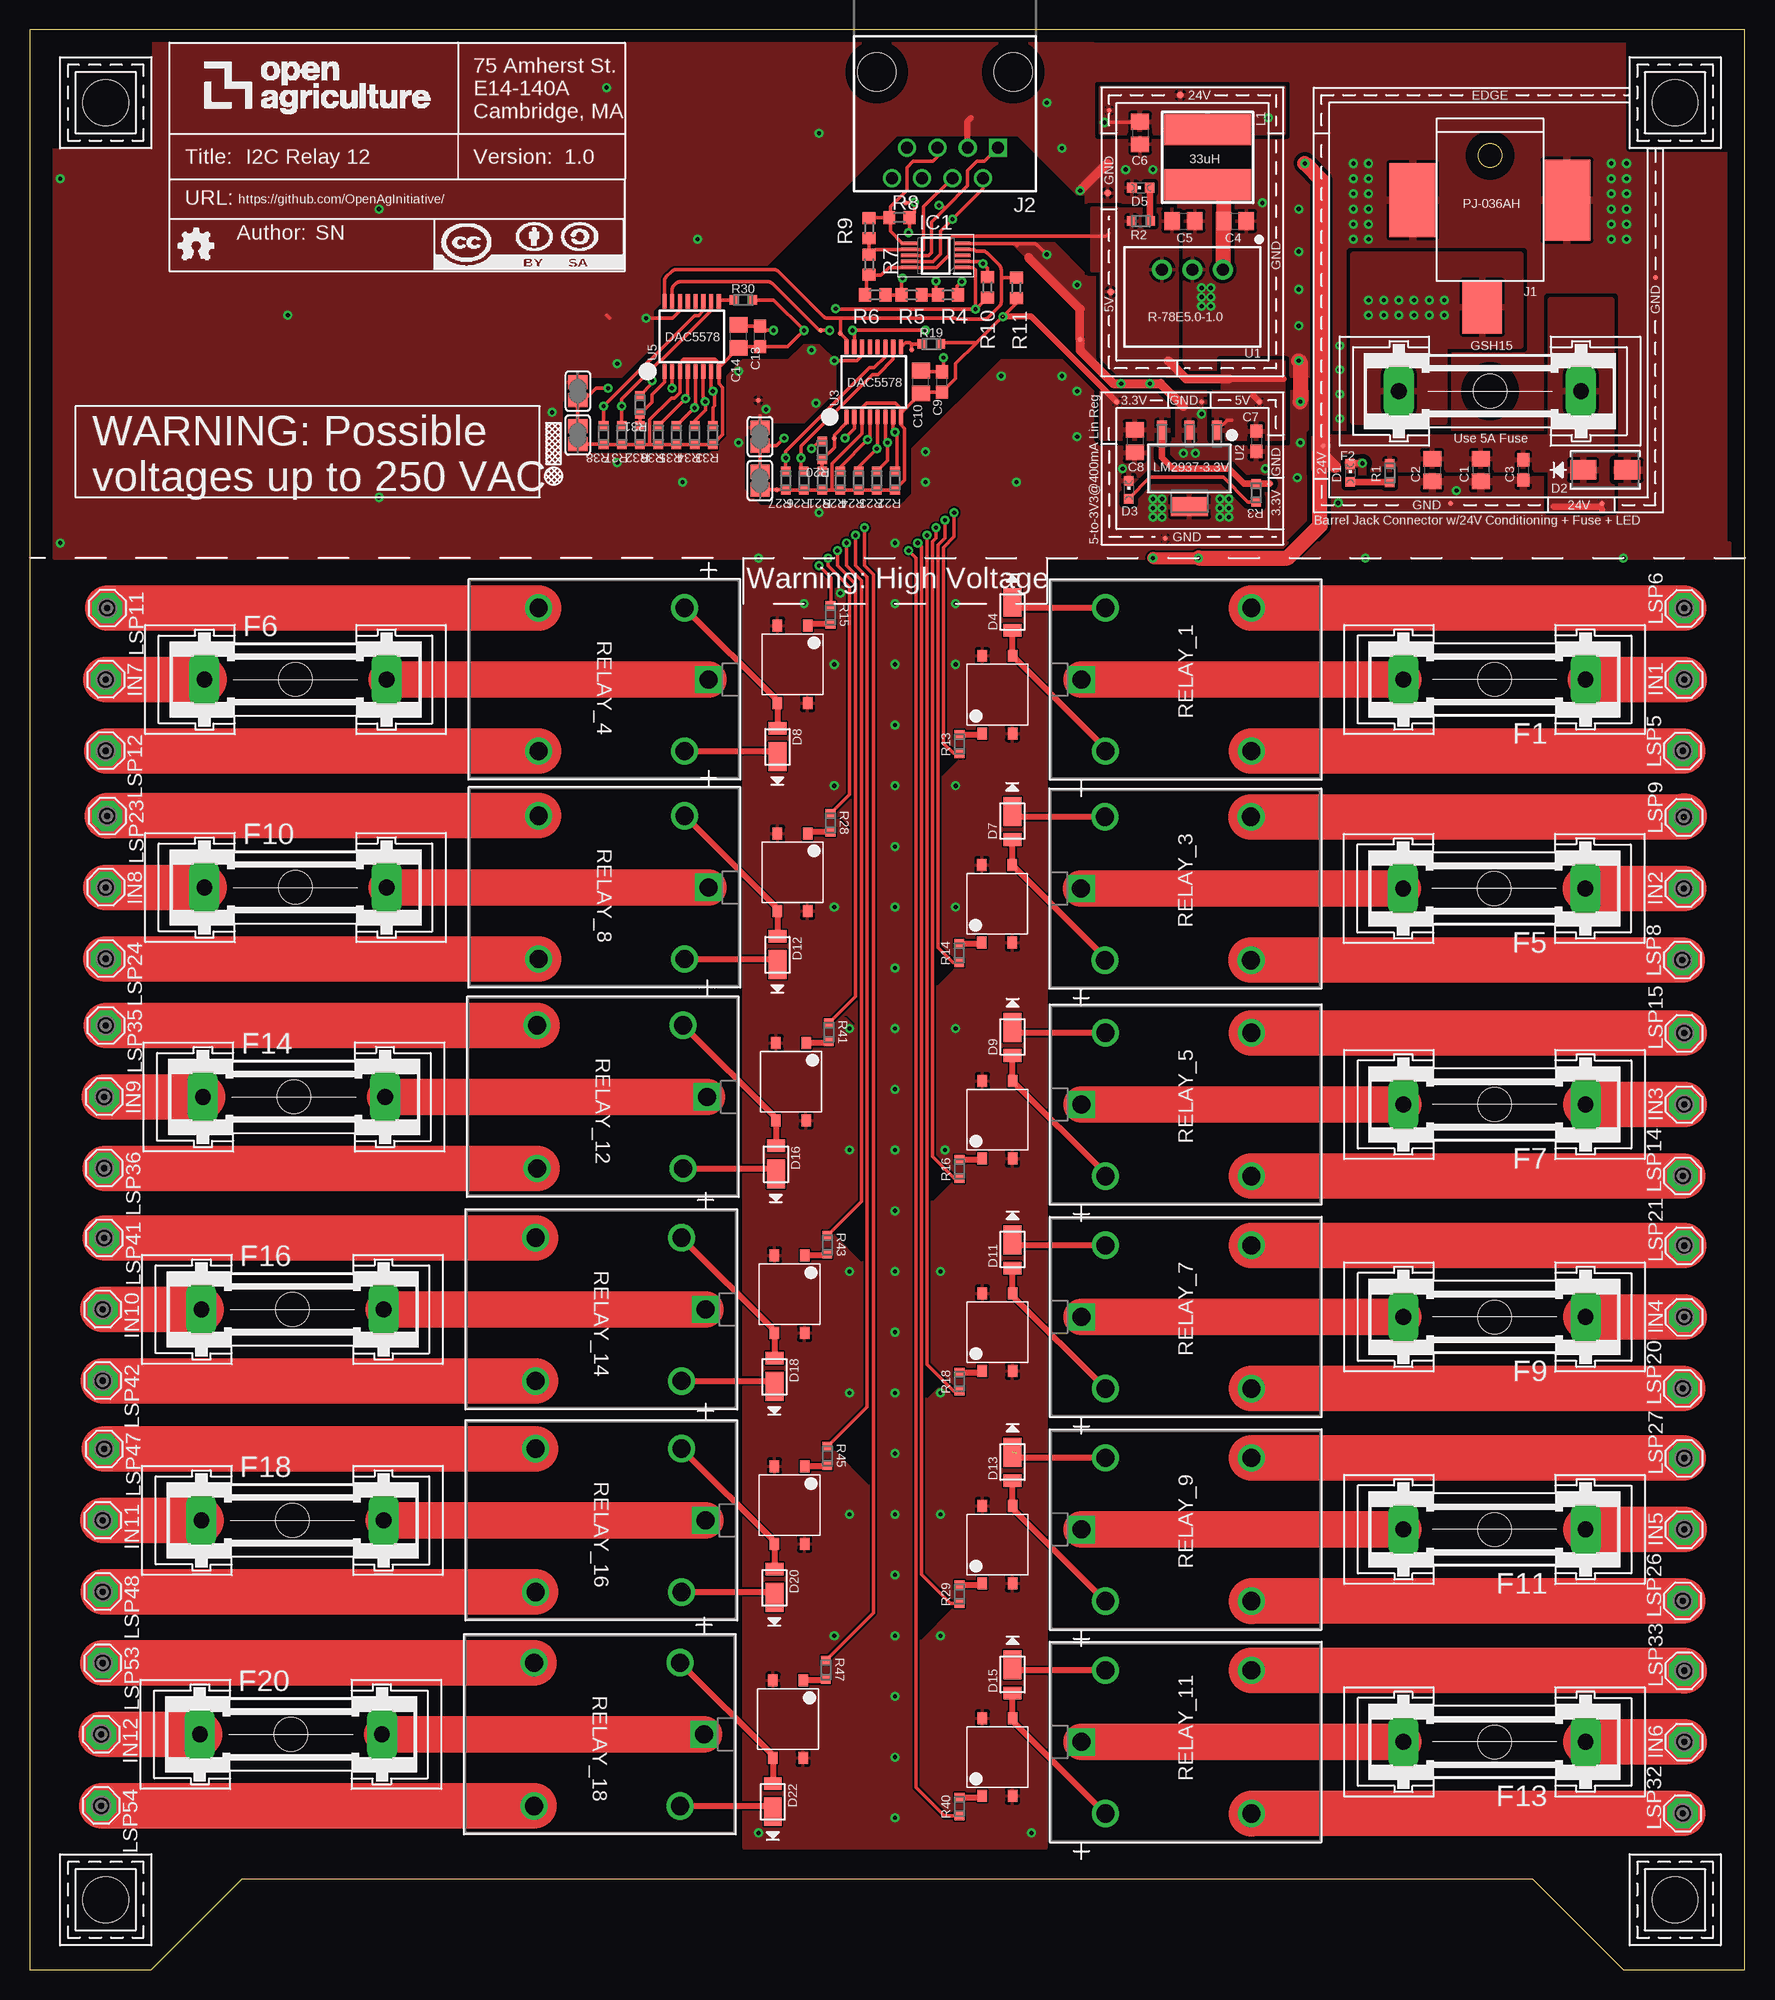
[diagram p3: board, top side]
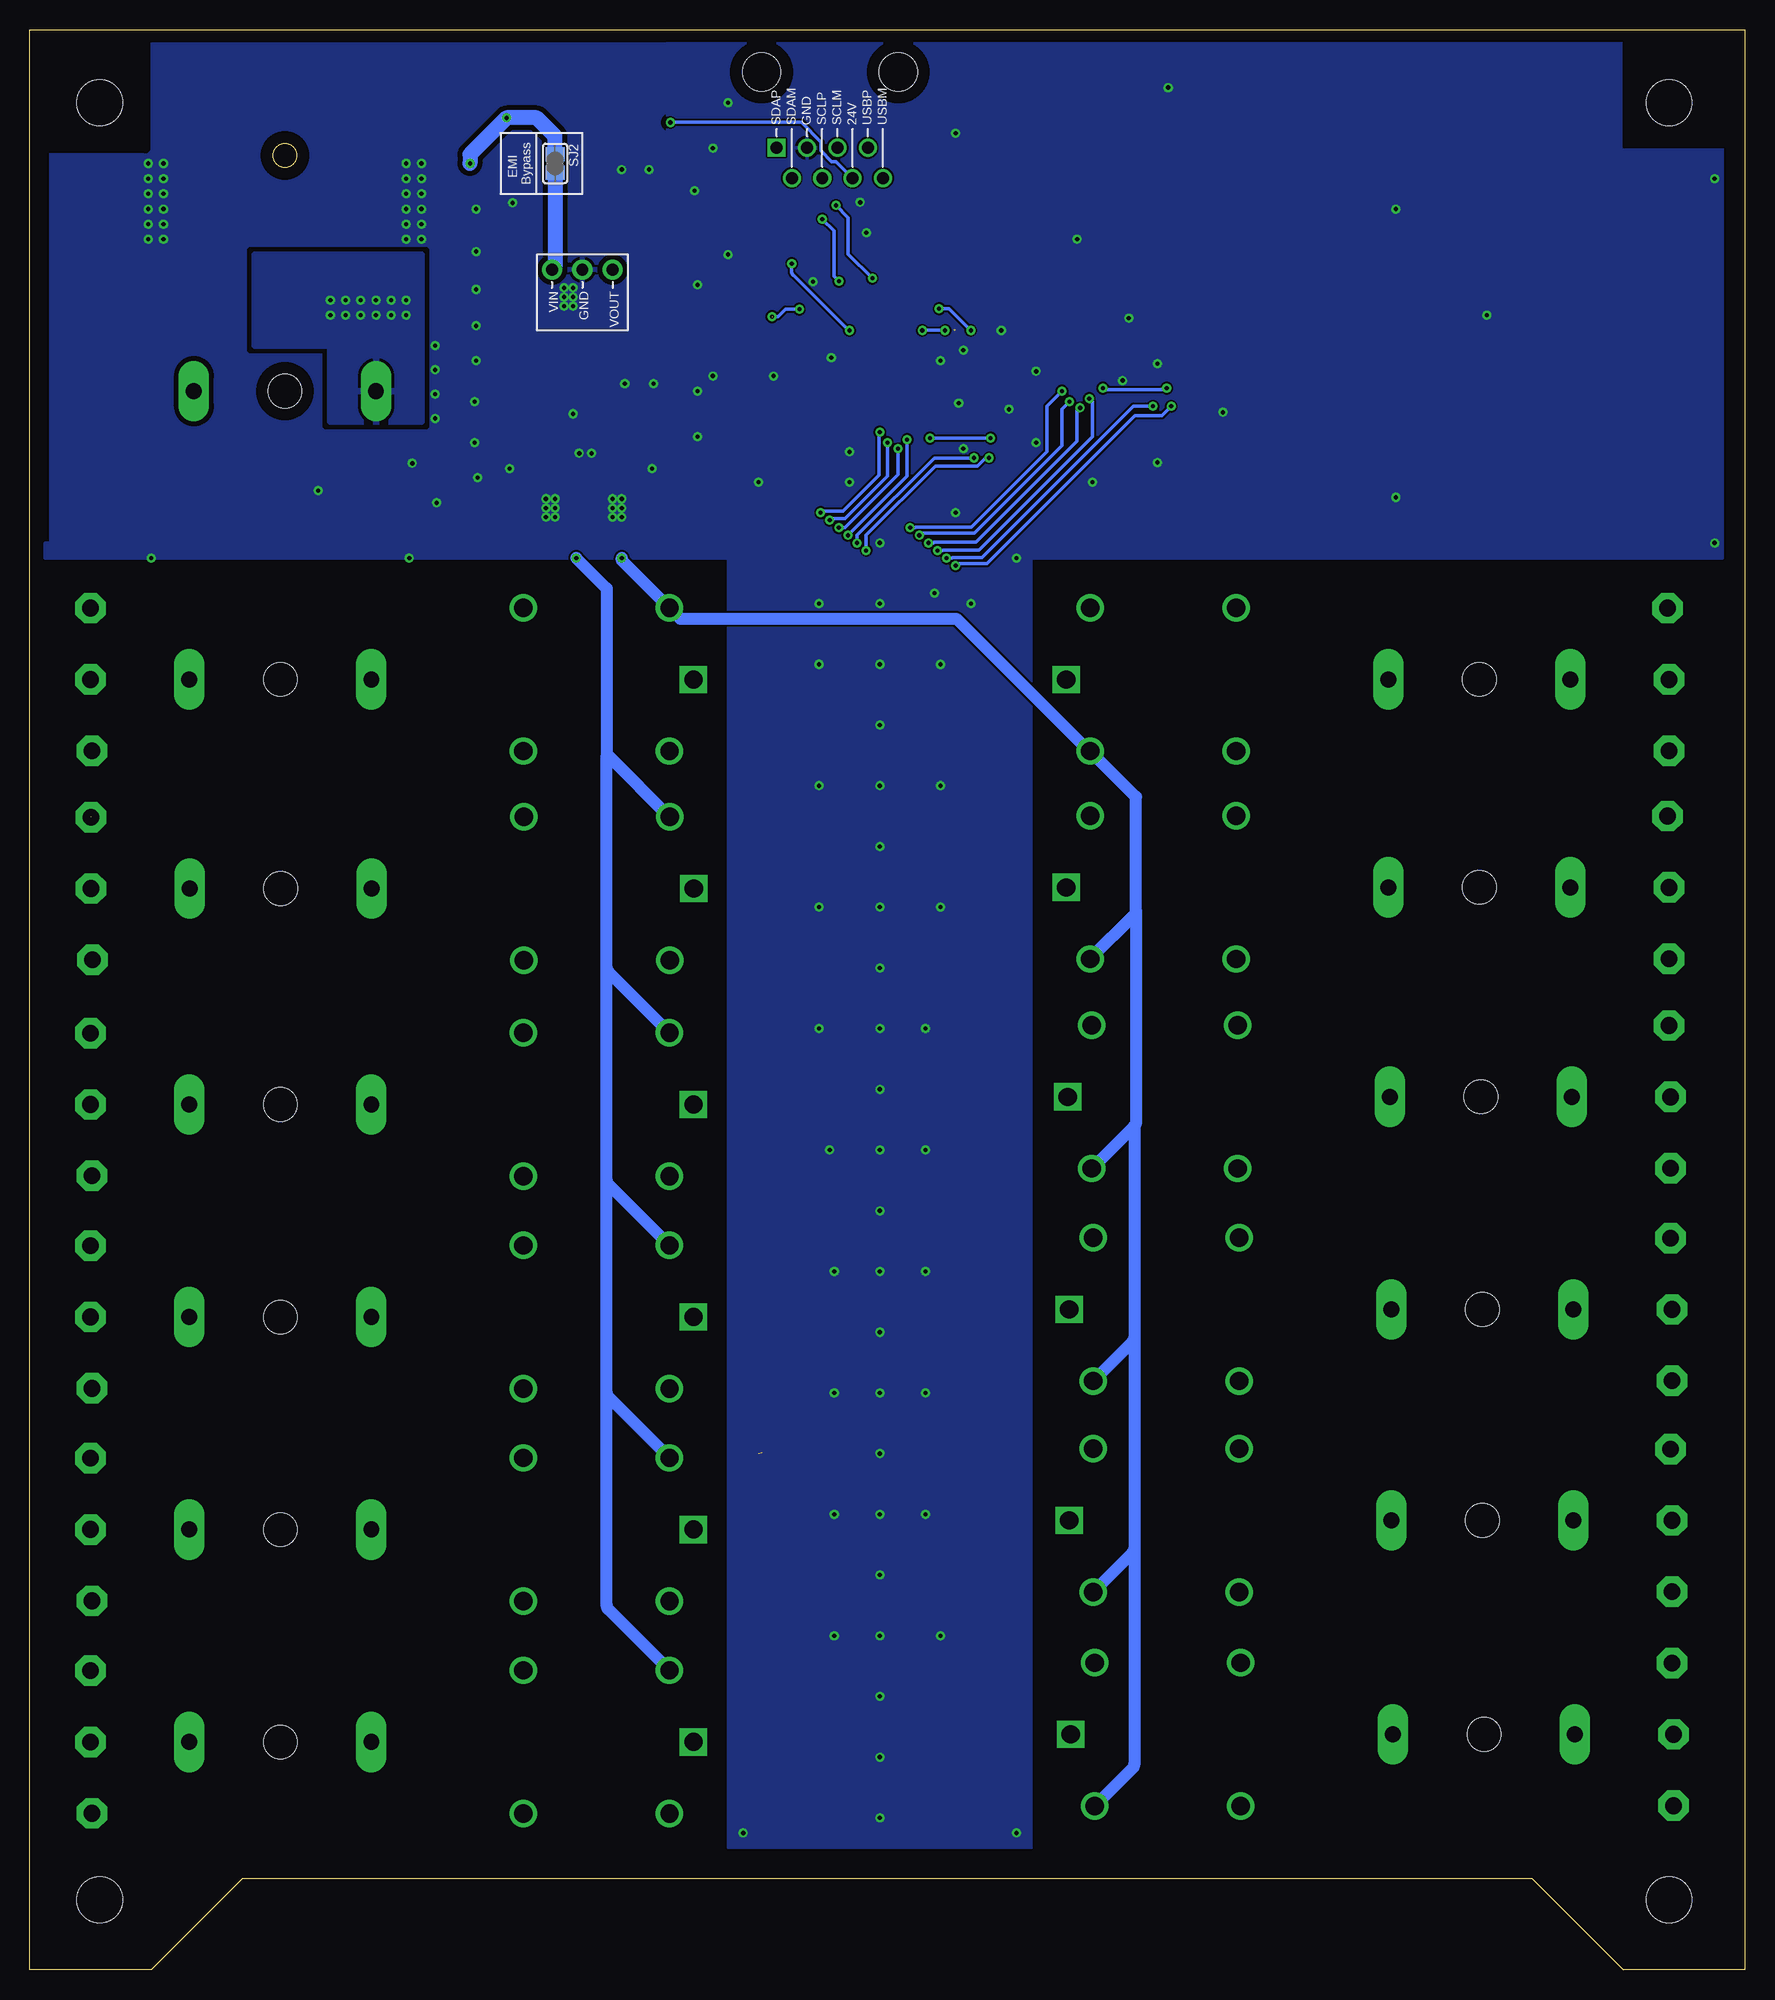
[diagram p4: board, bottom side, seen from below]

Size 143.51 x 162.31 mm. Coordinates in mm from the lower left corner, seen from the top.
Outline: 0,0 10.16,0 17.78,7.62 125.73,7.62 133.35,0 143.51,0 143.51,162.31 0,162.31 0,0
Copper layers (1*16): Top 0.035mm / dielectric 1.5mm / Bottom 0.035mm
Design rules "default": minimum track width 6mil, minimum drill 0.35mm, track to track 6mil, track to pad 6mil, pad to pad 6mil, via to via 6mil, smd to smd 6mil, copper to edge 40mil, drill to drill 6mil, minimum pad ring 10mil, minimum via ring 8mil, stop-mask expansion 4mil, vias tented up to drill 0mil, thermal gap 10mil
tRestrict: 16 lines

### Footprints (pad centres in the part's own frame; a part is rotated, then mirrored left to right if it is on the bottom)
C0805 = smd 1.3 x 1.5: 1 -0.95,0; 2 0.95,0
C0603 = smd 1.1 x 1: 1 -0.85,0; 2 0.85,0
CHIPLED_0603 = smd 0.8 x 0.8: A 0,-0.75; C 0,0.75
SMA = smd 2.18 x 1.63: 1 -1.857,0; 2 1.857,0
POWERDI123 = smd 1.05 x 1.5: + -1.3,0 | smd 2.4 x 1.5: - 1.05,0
GSH15 = drill 1.321 pad 2.54 long: 1 -7.62,0; 2 7.62,0 | hole 2.794: 0,0
SOP50P490X110-10N = smd 1.4 x 0.3: 1 -2.2,1; 2 -2.2,0.5; 3 -2.2,0; 4 -2.2,-0.5; 5 -2.2,-1; 6 2.2,-1; 7 2.2,-0.5; 8 2.2,0; 9 2.2,0.5; 10 2.2,1
SE14 = drill 1.397 pad 2.54 octagon: MP 0,0
BARREL-JACK-PJ-036AH = smd 4.4 x 3.3: 1 2.2,-0.65 | smd 6.75 x 3.9: 2 -6.75,6.45 | smd 6.2 x 3.9: 3 -6.75,-6.45
OPENAG-V1-RJ45 = drill 1: 24V(6) 1.905,8.89; DSCLM(5) 0.635,6.35; DSCLP(4) -0.635,8.89; DSDAM(2) -3.175,8.89; GND(3) -1.905,6.35; USBM(8) 4.445,8.89; USBP(7) 3.175,6.35 | drill 1 square: DSDAP(1) -4.445,6.35 | hole 3.2: -5.715,0; 5.715,0
29333C = smd 2.6 x 7.2: 1 -2.3,0; 2 2.3,0
RC0603N = smd 0.756 x 0.8: 1 -0.778,0; 2 0.778,0
R0603 = smd 1 x 1.1: 1 -0.85,0; 2 0.85,0
RELAY_G5LE-1 = drill 1.524 pad 2.032 square: 1 0,17.424 | drill 1.524 pad 2.032: 2 -5.994,15.418; 3 -5.994,3.2; 4 5.994,3.2; 5 5.994,15.418
EMI-BYPASS = smd 1.168 x 1.6: 1 -0.762,0.254; 2 0.762,0.254
SJ1 = smd 1.168 x 1.6: 1 -0.762,0; 2 0.762,0
TP04R = smd 0.4 x 0.4: 1 0,0
TP06R = smd 0.6 x 0.6: TP 0,0
R-78E5.0-1.0 = drill 1 pad 1.676: 1 -2.54,0; 2 0,0; 3 2.54,0
MP04A = smd 1.6 x 0.838: 1 -3.2,2.3; 2 -3.2,0; 3 -3.2,-2.3 | smd 1.6 x 3.099: 4 3.2,0
TSSOP16 = smd 0.35 x 1.2: 1 -2.275,-2.925; 2 -1.625,-2.925; 3 -0.975,-2.925; 4 -0.325,-2.925; 5 0.325,-2.925; 6 0.975,-2.925; 7 1.625,-2.925; 8 2.275,-2.925; 9 2.275,2.925; 10 1.625,2.925; 11 0.975,2.925; 12 0.325,2.925; 13 -0.325,2.925; 14 -0.975,2.925; 15 -1.625,2.925; 16 -2.275,2.925
CORNER = hole 3.81: 0,0
LTV-355T = smd 0.8 x 1: N1 -1.27,-3.25; N2 1.27,-3.25; N3 -1.27,3.25; N4 1.27,3.25

### Placement (x,y rotation side)
ATTRIBUTES  [DOCFIELD]  11.7,142.13 0 top
C1  121.41,125.48 270 top
C2  117.35,125.48 270 top
C3  124.97,125.48 270 top
C4  100.84,146.3 0 top
C5  96.52,146.3 0 top
C6  92.9,153.67 270 top
C7  102.62,127.89 270 top
C8  92.46,127.89 270 top
C9  76.33,132.84 90 top
C10  74.55,132.84 90 top
C13  61.09,136.65 90 top
C14  59.31,136.65 90 top
D1  110.49,125.22 0 top
D2  131.83,125.48 0 top
D3  91.95,123.82 0 top
D4  82.23,113.35 90 top
D5  92.96,149.1 90 top
D7  82.2,95.86 90 top
D8  62.55,102.55 270 top
D9  82.23,77.79 90 top
D11  82.23,60.01 90 top
D12  62.55,85.15 270 top
D13  82.23,42.23 90 top
D15  82.23,24.45 90 top
D16  62.42,67.63 270 top
D18  62.29,49.85 270 top
D20  62.29,32.19 270 top
D22  62.17,14.29 270 top
F1  122.55,107.95 180 top
F2  122.17,132.08 0 top
F4  119.13,127.76 0 top
F5  122.53,90.46 180 top
F6  22.22,107.95 0 top
F7  122.55,72.39 180 top
F9  122.55,54.61 180 top
F10  22.22,90.55 0 top
F11  122.55,36.83 180 top
F13  122.55,19.05 180 top
F14  22.1,73.02 0 top
F16  21.97,55.24 0 top
F18  21.97,37.59 0 top
F20  21.84,19.68 0 top
IC1  75.81,143.43 180 top
IN1  138.43,107.95 90 top
IN2  138.4,90.46 90 top
IN3  138.43,72.39 90 top
IN4  138.43,54.61 90 top
IN5  138.43,36.83 90 top
IN6  138.43,19.05 90 top
IN7  6.35,107.95 270 top
IN8  6.35,90.55 270 top
IN9  6.22,73.02 270 top
IN10  6.1,55.24 270 top
IN11  6.1,37.59 270 top
IN12  5.97,19.68 270 top
J1  122.17,141.3 270 top
J2  76.57,158.79 180 top
L1  98.55,151.64 270 top
LSP5  138.3,101.98 90 top
LSP6  138.43,113.92 90 top
LSP8  138.27,84.49 90 top
LSP9  138.4,96.43 90 top
LSP11  6.48,113.92 270 top
LSP12  6.35,101.98 270 top
LSP14  138.3,66.42 90 top
LSP15  138.43,78.36 90 top
LSP20  138.3,48.64 90 top
LSP21  138.43,60.58 90 top
LSP23  6.48,96.52 270 top
LSP24  6.35,84.58 270 top
LSP26  138.3,30.86 90 top
LSP27  138.43,42.8 90 top
LSP32  138.3,13.08 90 top
LSP33  138.43,25.02 90 top
LSP35  6.35,78.99 270 top
LSP36  6.22,67.06 270 top
LSP41  6.22,61.21 270 top
LSP42  6.1,49.28 270 top
LSP47  6.22,43.56 270 top
LSP48  6.1,31.62 270 top
LSP53  6.1,25.65 270 top
LSP54  5.97,13.72 270 top
R1  113.79,125.22 90 top
R2  92.96,146.3 180 top
R3  102.62,123.57 90 top
R4  76.82,140.12 0 top
R5  73.78,140.12 0 top
R6  70.73,140.12 0 top
R7  70.22,142.66 270 top
R8  72.76,146.6 180 top
R9  70.22,145.71 270 top
R10  80.13,140.76 270 top
R11  82.55,140.72 270 top
R13  77.79,102.55 90 top
R14  77.76,85.06 90 top
R15  66.99,113.35 270 top
R16  77.79,66.99 90 top
R18  77.79,49.21 90 top
R19  75.44,136.02 180 top
R20  66.29,127.13 270 top
R21  66.29,124.59 90 top
R22  72.39,124.59 270 top
R23  70.87,124.59 270 top
R24  69.34,124.59 270 top
R25  67.82,124.59 270 top
R26  64.77,124.59 270 top
R27  63.25,124.59 270 top
R28  66.99,95.95 270 top
R29  77.79,31.43 90 top
R30  59.69,139.7 180 top
R31  51.05,130.94 270 top
R32  51.05,128.4 90 top
R33  57.15,128.4 270 top
R34  55.63,128.4 270 top
R35  54.1,128.4 270 top
R36  52.58,128.4 270 top
R37  49.53,128.4 270 top
R38  48.01,128.4 270 top
R40  77.79,13.65 90 top
R41  66.87,78.42 270 top
R43  66.74,60.64 270 top
R45  66.74,42.99 270 top
R47  66.61,25.08 270 top
RELAY_1  105.41,107.95 90 top
RELAY_3  105.38,90.46 90 top
RELAY_4  39.37,107.95 270 top
RELAY_5  105.41,72.39 90 top
RELAY_7  105.41,54.61 90 top
RELAY_8  39.37,90.55 270 top
RELAY_9  105.41,36.83 90 top
RELAY_11  105.41,19.05 90 top
RELAY_12  39.24,73.02 270 top
RELAY_14  39.12,55.24 270 top
RELAY_16  39.12,37.59 270 top
RELAY_18  38.99,19.68 270 top
SJ2  99.82,151.13 270 bottom
SJ_A1  61.09,124.59 90 top
SJ_A2  61.09,128.27 270 top
SJ_A5  45.85,128.4 90 top
SJ_A6  45.85,132.08 270 top
TP1  103.76,124.33 180 top
TP2  102.87,131.19 180 top
TP3  131.57,122.68 0 top
TP4  118.87,122.68 0 top
TP5  136.02,141.6 0 top
TP6  108.2,127.51 0 top
TP7  90.42,140.4 180 top
TP8  96.27,156.84 180 top
TP9  90.17,148.65 180 top
TP10  95,119.76 180 top
TP11  90.93,131.19 180 top
TP12  98.04,131.19 180 top
TP19  90.3,155.57 270 top
TP20  62.48,123.82 270 top
TP21  73.28,147.83 90 top
TP22  66.17,137.16 270 top
TP23  67.82,136.91 270 top
TP24  67.31,128.14 270 top
TP25  73.79,135.51 270 top
TP26  60.96,131.32 180 top
TP27  87.88,136.4 0 top
U1  97.28,142.24 180 top
U2  97.03,125.6 270 top
U3  70.61,132.84 0 top
U5  55.37,136.65 0 top
U$1  [CORNER]  137.67,156.21 180 top
U$2  [CORNER]  137.67,5.84 90 top
U$3  80.96,106.68 0 top
U$4  80.93,89.19 0 top
U$5  63.82,109.22 180 top
U$6  80.96,71.12 0 top
U$7  [CORNER]  6.35,156.21 270 top
U$8  80.96,53.34 0 top
U$9  63.82,91.82 180 top
U$10  80.96,35.56 0 top
U$11  [CORNER]  6.35,5.84 0 top
U$12  80.96,17.78 0 top
U$13  63.69,74.3 180 top
U$15  63.56,56.52 180 top
U$17  63.56,38.86 180 top
U$19  63.44,20.95 180 top

### Tracks (layer width: path | path; a pad name or v marks a point on that pad's centre or on a via)
24V_EMI
  Top 1.27: U1.1 99.89,142.31 C4.1 99.89,148 arc90 L1.2
  Bottom 1.27: SJ2.2 99.57,142.49 U1.1
24V_IN1  (via drill 0.35)
  other vias: 118.36,139.7 118.36,138.43 117.09,139.7 117.09,138.43 115.82,139.7 115.82,138.43 114.55,139.7 113.28,139.7 113.28,138.43 114.55,138.43 112.01,138.43 112.01,139.7
  pour Bottom (isolate 0.406): 118.36,129.54 110.74,129.54 110.74,143.51 124.71,143.51 124.71,135.89 118.36,135.89
  pour Top (isolate 0.406): 110.74,129.54 118.36,129.54 118.36,135.89 124.71,135.89 124.71,143.51 110.74,143.51
!LDAC!
  Top 0.305: R21.2 R20.2 67.31,127.37 TP24.1 67.31,128.4 68.34,129.42 U3.1
!LDAC!B
  Top 0.305: R32.2 R31.2 52.05,131.15 52.05,131.77 53.1,132.82 U5.1
+3V3  (via drill 0.35)  (1 unrouted)
  Top 0.305: U3.8 72.89,129.26 73.2,128.95 73.2,124.62 R22.2 R23.2 R24.2 R25.2 67.06,123.81 | SJ_A1.1 TP20.1 63.23,123.82 R27.2 R26.2 R21.1 67.06,123.81 | U3.8 72.89,130.23 C10.1 74.65,131.99 C9.1 77.47,133.13 77.47,134.37 79.25,136.14 79.21,136.14 | U3.8 72.89,130.62 72.44,131.06 69.99,131.06 69.64,130.71 U3.3 69.64,128.51 67.11,125.99 67.11,123.87 67.06,123.81 | U5.8 57.65,134.43 57.33,134.75 54.72,134.75 54.4,134.43 U5.3 54.4,132.62 54.4,131.95 53.96,131.51 53.7,131.51 51.87,129.68 51.87,127.68 51.82,127.62 | U5.8 57.65,134.04 C14.1 59.41,135.8 C13.1 63.41,135.8 v64.77,137.16 62.23,139.7 R30.1 | 51.82,127.62 R36.2 R35.2 R34.2 R33.2 57.96,128.43 57.96,132.38 57.65,132.69 U5.8 | 51.82,127.62 R32.1 R37.2 R38.2 47.99,127.63 SJ_A5.1 | IC1.1 78.93,142.43 79.12,142.24 v79.12,138.94 | R19.1 76.22,135.91 | 82.55,139.74 R11.2 82.55,139.45 v81.41,138.3 | 79.21,136.14 76.45,136.14 76.22,135.91 | 76.22,135.91 76.22,135.87 | v81.41,138.3 81.43,138.32 | R10.2 79.16,138.94 v79.12,138.94 | v79.12,138.94 67.47,138.94 v67.43,138.98 | 79.21,136.14 81.39,138.32 | 81.53,138.32 81.45,138.32 arc45 v81.41,138.3
  Top 0.508: TP11.1 83.8,138.32 81.53,138.32
  Top 0.559: TP1.1 102.63,124.33 R3.2 101.58,124.35 100.33,125.6 95.63,125.6 94.73,126.51 U2.3
  Bottom 0.305: v64.77,137.16 64.8,137.16 66.6,138.96 67.41,138.96 v67.43,138.98 | v79.12,138.94 80.26,138.94 80.9,138.3 v81.41,138.3
  pour Top (isolate 0.305): 89.66,131.95 89.66,128.14 95.25,128.14 95.25,131.95
+5V
  Top 0.305: U2.1 100.19,129.67 100.58,129.67 | 70.26,141.78 71.24,141.78 71.89,142.43 IC1.10 75.88,142.43 76.9,143.45 76.9,144.75 77.19,145.03 83.82,145.03 84.2,145.03 90.04,145.03 90.3,145.29 | 70.26,141.78 R7.2 | 70.26,141.78 70.01,141.52 70.01,140.25 R6.1 69.75,140.25
  Top 0.508: 104.9,133.1 100.33,133.1
  Top 0.559: TP2.1 102.36,131.7
  Top 0.762: 100.33,133.1 96.77,133.1 95.25,134.62
  pour Top (isolate 0.305): 89.66,133.35 89.66,147.32 96.01,147.32 96.01,133.35
  pour Top (isolate 0.406): 90.93,147.32 88.9,147.32 88.9,142.24 90.93,142.24
  pour Top (isolate 0.305): 104.9,131.95 99.06,131.95 99.06,128.14 104.9,128.14
  pour Top (isolate 0.406): 99.82,134.49 99.82,130.68 104.9,130.68 104.9,134.49
+24V  (via drill 0.35)  (1 unrouted)
  Top 0.305: TP3.1 131.57,122.17 | 92.71,154.94 92.33,154.56 v89.92,154.56
  Top 0.508: RELAY_18.5 61.71,13.69 D22.- | RELAY_16.5 61.84,31.6 D20.- | RELAY_14.5 61.84,49.25 D18.- | RELAY_12.5 61.97,67.03 D16.- | RELAY_8.5 62.09,84.56 D12.- | RELAY_4.5 62.09,101.96 D8.- | RELAY_3.5 82.66,96.45 D7.- | RELAY_1.5 82.69,113.94 D4.- | RELAY_5.5 82.69,78.38 D9.- | RELAY_7.5 82.69,60.6 D11.- | RELAY_11.5 82.69,25.04 D15.- | RELAY_9.5 82.91,42.82 82.55,43.18
  Top 0.559: 127.51,122.43 131.32,122.43 131.57,122.17
  Top 1.016: 109.22,125.73 108.35,126.6 | 108.35,126.6 107.95,127 | 108.35,126.6 arc-45 108.2,126.96 TP6.1 | v93.98,118.11 v97.79,118.11
  Top 1.27: v106.68,151.13 108.08,149.73 108.08,127.63 TP6.1 | 107.95,127 107.95,120.82 105.23,118.11 v97.79,118.11
  Bottom 0.305: v89.92,154.56 78.95,154.56 77.31,152.92 77.31,152.18 76.42,151.28 76.05,151.28 J2.24V(6)
  Bottom 1.016: 50.95,88.61 arc45 51.1,88.25 RELAY_8.5 | 50.95,88.61 50.95,70.95 arc45 51.1,70.59 | 51.1,70.59 RELAY_12.5 | 51.1,70.59 51.1,52.9 | 51.1,52.9 51.1,35.24 | 51.1,35.24 51.1,17.21 arc45 51.25,16.85 RELAY_18.5 | RELAY_16.5 51.25,34.88 arc-45 51.1,35.24 | RELAY_14.5 51.25,52.54 arc-45 51.1,52.9 | RELAY_11.5 95.1,30.15 arc45 95.25,30.51 95.25,48.26 | 95.25,48.26 95.25,66.04 | 95.25,66.04 95.25,83.82 | 95.25,83.82 95.25,101.6 | RELAY_9.5 95.12,47.96 arc45 95.25,48.26 | RELAY_7.5 95.12,65.74 arc45 95.25,66.04 | RELAY_5.5 95.12,83.52 arc45 95.25,83.82 | RELAY_3.5 95.01,101.5 arc-45 95.25,101.6 | 50.95,88.61 50.95,98.12 RELAY_4.5 54.91,101.96 65.98,113.03 89.08,113.03 RELAY_1.5 93.98,117.93 v93.98,118.11 | v97.79,118.11 95.25,115.57 95.25,101.6
  Bottom 1.27: SJ2.1 99.57,153.42 101.09,154.94 v103.63,154.94 106.68,151.89 v106.68,151.13
  pour Top (isolate 0.406): 132.33,122.3 132.33,139.7 127.25,139.7 127.25,122.3
  pour Top (isolate 0.406): 127.76,128.27 127.76,125.48 107.44,125.48 107.44,128.27
  pour Top (isolate 0.406): 89.66,153.67 89.66,157.48 104.9,157.48 104.9,153.67
ADDR0  (via drill 0.35)
  Top 0.305: U3.2 68.99,128.93 v68.2,128.14 | SJ_A1.2 SJ_A2.2 62.48,127.51 v63.12,128.14
  Bottom 0.305: v68.2,128.14 v63.12,128.14
ADDR0B  (via drill 0.35)
  Top 0.305: SJ_A5.2 45.85,130.81 | 45.85,130.81 SJ_A6.2 | v53.72,132.33 53.75,132.36 U5.2 | v48.39,132.33 47.37,132.33 45.85,130.81
  Bottom 0.305: v53.72,132.33 53.59,132.21 48.51,132.21 v48.39,132.33
DAC_!CLR!
  Top 0.305: R19.2 73.79,136.02 | U3.9 73.26,136.14 73.66,136.14 73.79,136.02 | TP25.1 73.79,136.02
DAC_!CLR!B
  Top 0.305: R30.2 57.77,139.7 U5.9
DIM1  (via drill 0.35)
  Top 0.305: U3.7 72.24,128.8 v72.39,128.65 72.39,128.62 72.54,128.47 72.54,125.36 R22.1 | R13.1 77.28,101.78 76.45,102.6 76.45,119 77.34,119.89 v77.34,121.92
  Bottom 0.305: v72.39,128.65 72.47,128.57 72.47,125.07 75.49,122.05 77.22,122.05 v77.34,121.92
DIM1B  (via drill 0.35)
  Top 0.305: R33.1 57.15,130.72 57.3,130.87 57.3,131.9 57.15,132.05 v57.15,132.08 57,132.23 U5.7 | R47.1 70.61,29.86 70.61,116.71 69.85,117.47 v69.85,120.65
  Bottom 0.305: v57.15,132.08 58.42,130.81 58.42,127 64.72,120.7 69.37,120.7 69.42,120.65 v69.85,120.65
DIM2  (via drill 0.35)
  Top 0.305: U3.6 71.59,127.93 v71.75,127.76 71.75,126.25 R23.1 | R14.1 77.25,84.28 76,85.54 76,119.19 76.58,119.77 v76.58,121.28
  Bottom 0.305: v76.58,121.28 76.45,121.41 75.31,121.41 71.75,124.97 v71.75,127.76
DIM2B  (via drill 0.35)
  Top 0.305: R34.1 55.63,129.57 56.54,130.48 56.54,131.17 v56.52,131.19 56.52,131.44 56.35,131.61 U5.6 | R45.1 70.05,47.08 70.05,116.52 69.09,117.49 v69.09,120.01
  Bottom 0.305: v56.52,131.19 57.15,130.56 57.15,127.51 64.46,120.19 68.91,120.19 v69.09,120.01
DIM3  (via drill 0.35)
  Top 0.305: U3.5 70.94,127.32 v70.87,127.25 69.34,125.73 R24.1 | R16.1 77.37,66.22 75.54,68.05 75.54,119.48 75.82,119.76 v75.82,120.65
  Bottom 0.305: v70.87,127.25 70.87,125.09 75.31,120.65 v75.82,120.65
DIM3B  (via drill 0.35)
  Top 0.305: 55.7,130.68 v55.63,130.68 | v55.63,130.68 54.12,129.17 R35.1 | U5.5 55.7,130.75 v55.63,130.68 | R43.1 69.6,64.28 69.6,116.2 68.33,117.47 v68.33,119.38
  Bottom 0.305: v55.63,130.68 55.88,130.43 55.88,127.89 64.34,119.43 67.85,119.43 67.89,119.38 v68.33,119.38
DIM4  (via drill 0.35)
  Top 0.305: U3.4 70.29,128.17 70.14,128.02 v70.1,128.02 67.82,125.73 R25.1 | R18.1 77.28,48.43 75.06,50.66 v75.06,120.01
  Bottom 0.305: v70.1,128.02 70.1,124.97 v75.06,120.01
DIM4B  (via drill 0.35)
  Top 0.305: R36.1 52.59,129.17 v54.86,131.44 55.05,131.63 U5.4 | R41.1 69.09,81.42 69.09,115.95 67.56,117.47 v67.56,118.75
  Bottom 0.305: v54.86,131.44 54.61,131.19 54.61,128.27 64.09,118.79 67.08,118.79 67.13,118.75 v67.56,118.75
DIM5  (via drill 0.35)
  Top 0.305: U3.10 72.24,134.74 70.96,133.46 70.5,133.46 64.52,127.48 v64.52,126.49 64.52,125.62 R26.1 | R29.1 77.02,30.65 74.6,33.08 74.6,119.07 v74.3,119.38
  Bottom 0.305: v64.52,126.49 67.82,126.49 74.3,120.01 v74.3,119.38
DIM5B  (via drill 0.35)
  Top 0.305: R37.1 v49.53,130.81 49.53,131.42 52.78,134.67 52.87,134.67 57,138.8 U5.10 | R28.1 68.58,98.31 68.58,115.7 66.8,117.47 v66.8,118.11
  Bottom 0.305: v49.53,130.81 51.18,130.81 63.83,118.16 66.32,118.16 66.37,118.11 v66.8,118.11
DIM6  (via drill 0.35)
  Top 0.305: U3.11 71.59,134.96 70.65,134.02 70.27,134.02 63.25,127 v63.25,126.49 R27.1 63.26,125.36 | R40.1 76.52,12.88 74.14,15.25 74.14,118.11 73.53,118.72 v73.53,118.75
  Bottom 0.305: v63.25,126.49 63.55,126.49 64.23,125.81 67.74,125.81 73.53,120.01 v73.53,118.75
DIM6B  (via drill 0.35)
  Top 0.305: R38.1 v48.01,130.81 | v48.01,130.81 | v48.01,130.81 55.6,138.41 55.94,138.41 56.35,138.81 U5.11 | R15.1 67.06,114.19 67.06,116.46 v66.04,117.47
  Bottom 0.305: v48.01,130.81 48.77,130.05 51.04,130.05 63.44,117.65 65.86,117.65 v66.04,117.47
DSCLM1
  Top 0.305: R9.1 70.26,146.6 71.74,146.6 R8.2 72,146.6 | IC1.6 73.03,144.43 72,145.46 72,146.6 | 72,146.6 72,147.49 73.4,148.89 73.4,150.79 73.9,151.3 75.55,151.3 75.94,151.68 J2.DSCLM(5)
DSCLP1
  Top 0.305: R9.2 R7.1 70.77,143.93 71.24,143.93 71.37,143.93 IC1.7 74.78,143.93 74.79,143.93 74.79,147.49 J2.DSCLP(4)
DSDAM1  (via drill 0.35)
  Top 0.305: IC1.9 73.62,142.92 75.55,142.92 76.19,143.55 76.19,145.46 v77.21,146.47 79.75,149.01 J2.DSDAM(2) | R5.2 R4.1 arc-90 75.81,140.29 v75.81,141.27
  Bottom 0.305: v77.21,146.47 76.24,145.5 76.24,141.69 v75.81,141.27
DSDAP1  (via drill 0.35)
  Top 0.305: R6.2 R5.1 72.93,141.43 v73.02,141.52 | 76.57,147.36 75.43,146.22 75.43,143.68 75.17,143.43 IC1.8 | 76.57,147.36 78.48,149.27 78.48,150.54 79.24,151.3 79.87,151.3 J2.DSDAP(1) | v76.06,147.62 76.32,147.62 76.57,147.36
  Bottom 0.305: v73.02,141.52 75.05,143.55 75.05,146.6 v76.06,147.62
GND  (via drill 0.35)
  Top 0.305: C10.2 74.65,133.69 C9.2 76.45,133.82 v76.45,134.87 | C14.2 59.41,137.5 C13.2 61.43,137.16 v62.23,137.16 | R4.2 77.67,140.51 77.6,140.59 77.6,140.84 v77.98,141.22 | R31.1 52.07,132.73 v52.07,132.97 | R20.1 66.06,127.91 v65.41,127.25 | U3.14 69.64,135.04 69.21,134.62 v67.31,134.62 | 61.09,130.05 SJ_A2.1 | U5.14 54.4,138.81 53.76,138.18 v51.56,138.18 | v73.52,145.33 73.61,145.42 R8.1 74.03,147.02 v74.03,147.87 73.99,147.83 TP21.1 | 46.36,132.84 SJ_A6.1 | IC1.5 82.4,144.43 | 82.4,144.43 82.57,144.25 | 48.51,138.18 48.26,138.43 | 82.4,144.43 83.96,144.43 arc-45 84.32,144.28 v85.09,143.51
  Top 0.508: J2.GND(3) 78.48,154.68 78.74,154.94
  Top 0.559: D1.C 110.55,126.03 v111.51,126.03
  Top 0.762: 96.52,130.81 94.61,132.72 v93.73,132.72 v91.31,132.72 90.66,132.72 87.88,135.5 TP27.1 87.88,138.94 83.57,143.26 | v87.88,148.84 90.17,151.13
  Top 1.27: v106.17,134.62 106.3,134.49 v106.3,131.19
  other vias: 112.01,151.13 112.01,149.86 112.01,148.59 112.01,147.32 112.01,146.05 112.01,144.78 110.74,144.78 110.74,146.05 110.74,147.32 110.74,148.59 110.74,149.86 110.74,151.13 132.33,151.13 132.33,149.86 132.33,148.59 132.33,147.32 132.33,146.05 132.33,144.78 133.6,144.78 133.6,146.05 133.6,147.32 133.6,148.59 133.6,149.86 133.6,151.13 119.38,123.75 109.47,122.73 93.98,150.62 103.12,147.83 98.04,140.72 98.04,139.95 98.81,139.95 98.81,140.72 98.04,139.19 98.81,139.19 91.69,150.62 99.57,122.3 99.57,123.06 100.33,122.3 100.33,123.06 99.57,121.54 100.33,121.54 94.74,123.06 93.98,123.06 94.74,122.3 94.74,121.54 93.98,122.3 93.98,121.54 97.54,126.87 91.44,125.6 96.52,126.87 103.38,125.6 98.04,130.17 61.59,130.56 106.17,147.32 106.17,143.76 106.17,140.59 106.17,137.54 109.6,129.79 109.6,131.83 109.6,133.86 109.6,135.89 106.3,127.76 106.05,124.84 81.28,133.35 86.36,133.35 87.63,132.08 87.63,128.27 59.31,127.76 59.31,133.73 65.41,135.51 65.79,131.06 49.15,134.37 87.63,140.97 74.93,127 72.39,63.5 72.39,68.58 72.39,73.66 72.39,78.74 72.39,83.82 72.39,88.9 72.39,93.98 72.39,99.06 72.39,104.14 72.39,114.3 72.39,109.22 72.39,58.42 72.39,53.34 72.39,48.26 72.39,43.18 72.39,38.1 72.39,33.02 72.39,27.94 72.39,22.86 72.39,17.78 67.82,115.19 72.39,119.38 66.04,121.92 74.93,124.46 64.77,114.3 67.31,109.22 67.31,99.06 77.47,99.06 77.47,109.22 77.47,114.3 77.47,88.9 67.31,88.9 68.58,78.74 77.47,78.74 68.58,68.58 68.58,58.42 68.58,48.26 68.58,38.1 67.31,27.94 76.2,27.94 76.2,38.1 76.2,48.26 76.2,58.42 76.58,68.58 60.96,118.11 54.61,124.46 82.55,124.46 111.76,118.11 133.35,118.11 55.88,144.78 66.04,153.67 85.09,156.21 86.36,152.4 43.69,130.3 49.15,126.11 48.26,157.48 29.21,123.19 29.21,147.32 60.96,11.43 72.39,12.7 83.82,11.43 21.59,138.43 2.54,149.86 2.54,119.38
  pour Top (isolate 0.305, rank 2): 107.44,119.38 107.44,161.29 141.73,161.29 141.73,119.38
  pour Bottom (isolate 0.406, rank 2): 107.44,161.29 141.73,161.29 141.73,119.38 107.44,119.38
  pour Top (isolate 0.305, rank 2): 88.39,133.35 88.39,161.29 107.44,161.29 107.44,133.35
  pour Bottom (isolate 0.406, rank 2): 107.44,133.35 107.44,161.29 88.9,161.29 88.9,133.35
  pour Top (isolate 0.406, rank 3): 107.44,119.25 107.44,131.95 89.66,131.95 89.66,119.25
  pour Bottom (isolate 0.406): 107.7,119.25 89.66,119.25 89.66,133.22 107.7,133.22
  pour Bottom: 90.17,162.56 90.17,119.38 142.24,119.38 142.24,118.11 1.9,118.11 1.9,162.56
  pour Top: 88.9,148.59 88.9,161.92 2.03,161.92 2.03,118.11 142.24,118.11 142.24,119.38 90.17,119.38 90.17,126.62 88.9,127.89 88.9,132.08 86.36,134.62 81.28,134.62 73.91,127.25 73.91,123.44 72.9,122.43 61.09,122.43 56.77,126.75 44.7,126.75 44.45,127 44.45,131.19 55.88,142.62 61.59,142.62 72.52,153.54 82.68,153.54 87.63,148.59
  pour Top: 55.88,125.73 58.42,128.27 58.42,133.35 59.69,134.62 63.5,134.62 64.77,135.89 66.04,135.89 67.31,134.62 67.31,132.08 64.77,129.54 60.96,129.54 59.69,128.27 59.69,127 59.69,121.92
  pour Top: 52.07,142.24 52.07,135.89 49.53,133.35 41.91,133.35 50.8,142.24
  pour Top: 82.42,144.4 85.72,144.4 88.14,141.99 88.14,138.94 87.76,138.94 82.42,144.27
  pour Top: 59.69,118.11 59.69,10.16 85.09,10.16 85.09,118.11
  pour Bottom: 59.69,118.11 59.69,10.16 85.09,10.16 85.09,118.11
N$1
  Top 0.559: D1.A 110.52,124.44 R1.1
N$3
  Top 0.559: R2.1 93.74,149.07 D5.A
N$4
  Top 0.305: D3.A 93.74,124.87 99.85,124.87 101.93,122.79 R3.1
N$7
  Top 0.508: D4.+ U$3.N4 89.99,102.17 RELAY_1.2
N$11
  Top 3.048: F1.2 RELAY_1.1
N$13
  Top 3.81: LSP5.MP 102.23,101.98 RELAY_1.3
N$14
  Top 0.508: R13.2 79.45,103.33 arc45 U$3.N1
N$15
  Top 3.048: 138.41,113.94 LSP6.MP
  Top 3.81: RELAY_1.4 138.41,113.94
N$16
  Top 3.048: 130.81,107.95 F1.1
  Top 3.81: IN1.MP 130.81,107.95
N$17
  Top 0.508: D7.+ U$4.N4 89.96,84.68 RELAY_3.2
N$18
  Top 3.048: F5.2 RELAY_3.1
N$19
  Top 3.81: LSP8.MP 102.21,84.49 RELAY_3.3
N$20
  Top 0.508: R14.2 79.42,85.84 arc45 U$4.N1
N$21  (1 unrouted)
  Top 3.81: RELAY_3.4 138.36,96.45 138.43,96.52
N$22
  Top 3.81: F5.1 IN2.MP
N$23
  Top 0.508: D8.+ U$5.N4 62.55,106.19 RELAY_4.2
N$24
  Top 3.048: RELAY_4.1 F6.2
N$25
  Top 3.048: 6.5,113.94 LSP11.MP
  Top 3.81: RELAY_4.3 6.5,113.94
N$26
  Top 0.508: R15.2 65.33,112.57 arc45 U$5.N1
N$27
  Top 2.54: 6.41,101.96 arc-45 LSP12.MP
  Top 3.81: RELAY_4.4 6.41,101.96
N$28
  Top 3.81: IN7.MP F6.1
N$29
  Top 0.508: D9.+ U$6.N4 89.99,66.61 RELAY_5.2
N$30
  Top 3.048: F7.2 RELAY_5.1
N$31
  Top 3.81: LSP14.MP 102.23,66.42 RELAY_5.3
N$32
  Top 0.508: R16.2 79.45,67.77 arc45 U$6.N1
N$33
  Top 3.81: RELAY_5.4 138.41,78.38 LSP15.MP
N$34
  Top 3.81: IN3.MP F7.1
N$41
  Top 0.508: D11.+ U$8.N4 82.23,56.38 RELAY_7.2
N$42
  Top 3.048: F9.2 RELAY_7.1
N$43
  Top 3.81: LSP20.MP 102.23,48.64 RELAY_7.3
N$44
  Top 0.508: R18.2 79.45,49.99 arc45 U$8.N1
N$45
  Top 3.048: 138.41,60.6 LSP21.MP
  Top 3.81: RELAY_7.4 138.41,60.6
N$46
  Top 3.81: F9.1 IN4.MP
N$47
  Top 0.508: D12.+ U$9.N4 62.55,88.79 RELAY_8.2
N$48
  Top 3.048: F10.2 RELAY_8.1
N$49
  Top 3.81: RELAY_8.3 6.5,96.54 LSP23.MP
N$50
  Top 0.508: R28.2 65.33,95.17 arc45 U$9.N1
N$51
  Top 3.81: RELAY_8.4 6.38,84.56 LSP24.MP
N$52
  Top 3.81: F10.1 IN8.MP
N$53
  Top 0.508: D13.+ U$10.N4 82.23,38.59 RELAY_9.2
N$54
  Top 3.048: RELAY_9.1 F11.2
N$55
  Top 3.81: LSP26.MP 102.23,30.86 RELAY_9.3
N$56
  Top 0.508: R29.2 79.45,32.21 arc45 U$10.N1
N$57
  Top 2.54: 138.37,42.82 arc-45 LSP27.MP
  Top 3.81: RELAY_9.4 138.37,42.82
N$58
  Top 3.81: IN5.MP F11.1
N$65
  Top 0.508: D15.+ U$12.N4 82.23,20.81 RELAY_11.2
N$66
  Top 3.048: F13.2 RELAY_11.1
N$67
  Top 3.81: LSP32.MP 102.23,13.08 RELAY_11.3
N$68
  Top 0.508: R40.2 79.45,14.43 arc45 U$12.N1
N$69
  Top 3.81: RELAY_11.4 138.41,25.04 LSP33.MP
N$70
  Top 3.81: F13.1 IN6.MP
N$71
  Top 0.508: D16.+ U$13.N4 62.42,71.26 RELAY_12.2
N$72
  Top 3.048: RELAY_12.1 F14.2
N$73
  Top 3.048: 6.38,79.02 LSP35.MP
  Top 3.81: RELAY_12.3 6.38,79.02
N$74
  Top 0.508: R41.2 arc-45 66.62,77.55 U$13.N1
N$75
  Top 2.54: 6.28,67.03 arc-45 LSP36.MP
  Top 3.81: RELAY_12.4 6.28,67.03
N$76
  Top 3.81: IN9.MP F14.1
N$83
  Top 0.508: D18.+ U$15.N4 62.29,53.48 RELAY_14.2
N$84
  Top 3.048: F16.2 RELAY_14.1
N$85
  Top 2.54: 6.28,61.24 arc45 LSP41.MP
  Top 3.81: RELAY_14.3 6.28,61.24
N$86
  Top 0.508: R43.2 arc-45 66.5,59.77 U$15.N1
N$87
  Top 3.048: 6.12,49.25 LSP42.MP
  Top 3.81: RELAY_14.4 6.12,49.25
N$88
  Top 3.81: F16.1 IN10.MP
N$95
  Top 0.508: D20.+ U$17.N4 62.29,35.83 RELAY_16.2
N$96
  Top 3.048: RELAY_16.1 F18.2
N$97
  Top 3.81: LSP47.MP 42.29,43.56 RELAY_16.3
N$98
  Top 0.508: R45.2 arc-45 66.5,42.11 U$17.N1
N$99
  Top 3.048: 6.12,31.6 LSP48.MP
  Top 3.81: RELAY_16.4 6.12,31.6
N$100
  Top 3.81: IN11.MP F18.1
N$107
  Top 0.508: D22.+ U$19.N4 62.17,17.92 RELAY_18.2
N$108
  Top 3.048: F20.2 RELAY_18.1
N$109
  Top 3.81: LSP53.MP 42.16,25.65 RELAY_18.3
N$110
  Top 0.508: R47.2 arc-45 66.37,24.2 U$19.N1
N$111
  Top 2.54: 6.03,13.69 arc-45 LSP54.MP
  Top 3.81: RELAY_18.4 6.03,13.69
N$112
  Top 3.81: IN12.MP F20.1
SCL
  Top 0.305: U3.16 68.34,136.39 TP23.1 67.82,138.18 | 67.82,138.18 77.47,138.18 77.55,138.1 79.84,138.1 arc45 80.19,138.25 81.13,139.19 arc45 81.28,139.54 81.28,141.6 | IC1.4 79.02,143.93 79.15,143.8 79.72,143.8 arc-45 80.08,143.65 81.13,142.6 arc-45 81.28,142.25 81.28,141.6 | R11.1 81.32,141.57 81.28,141.6 | U5.16 53.1,141.28 arc-45 53.25,141.64 53.7,142.09 arc-45 54.06,142.24 62.27,142.24 arc-45 62.63,142.09 66.4,138.32 arc45 66.76,138.18 67.82,138.18
SDA  (via drill 0.35)  (1 unrouted)
  Top 0.305: v66.93,137.16 66.04,137.16 62.12,141.07 arc45 61.77,141.22 54.4,141.22 arc45 54.04,141.07 53.9,140.93 arc45 53.75,140.57 U5.15 | U3.15 68.99,137.01 v68.83,137.16 v74.93,137.16 | IC1.2 79.58,142.93 v79.76,142.75 80.13,142.38 R10.1
  Bottom 0.305: v79.76,142.75 79.78,142.72 79.78,142.12 arc-45 79.63,141.77 75.02,137.16 v74.93,137.16 | v66.93,137.16 v68.83,137.16

### Text on the board
tPlace: 24V | EDGE | GND | GND | GND | 5V | 3.3V | GND | 5V | GND | 24V | 3.3V | WARNING: Possible / voltages up to 250 VAC | GND | 24V | Barrel Jack Connector w/24V Conditioning + Fuse + LED | GND | 5-to-3V3@400mA Lin Reg | Warning: High Voltage